# EAGLE design muledrum-vcos (EAGLE 6.6.0)

## Sheet 1 of 5: VCO1
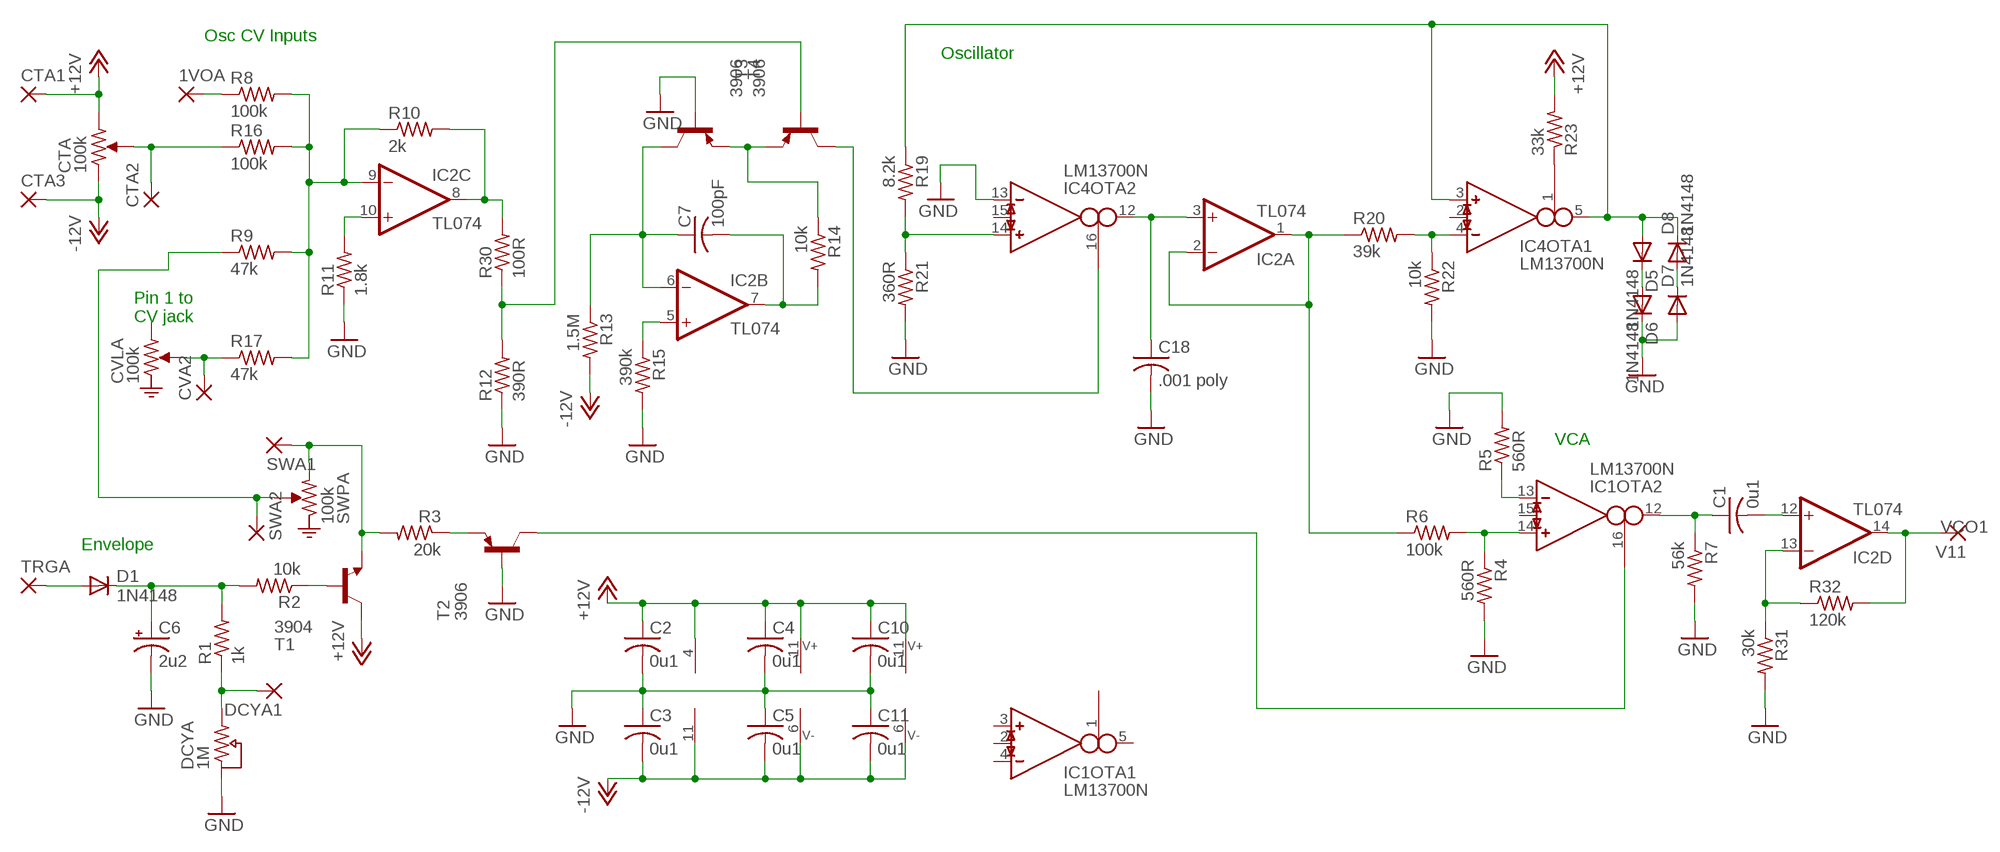
[diagram p0: schematic, sheet 1]

### Parts
1VOA  2,54/1,0  [2,54/1,0]
C1  0u1  C-US050-025X075  [C050-025X075]
C2  0u1  C-US050-025X075  [C050-025X075]
C3  0u1  C-US050-025X075  [C050-025X075]
C4  0u1  C-US050-025X075  [C050-025X075]
C5  0u1  C-US050-025X075  [C050-025X075]
C6  2u2  CPOL-USE2.5-5  [E2,5-5]
C7  100pF  C-US050-025X075  [C050-025X075]
C10  0u1  C-US050-025X075  [C050-025X075]
C11  0u1  C-US050-025X075  [C050-025X075]
C18  .001 poly  C-US050-025X075  [C050-025X075]
CTA  100k  POT  (no package)
CTA1  2,54/1,0  [2,54/1,0]
CTA2  2,54/1,0  [2,54/1,0]
CTA3  2,54/1,0  [2,54/1,0]
CVA2  2,54/1,0  [2,54/1,0]
CVLA  100k  POT-ATTEN  (no package)
D1  1N4148  1N4148DO35-7  [DO35-7]
D5  1N4148  1N4148DO35-7  [DO35-7]
D6  1N4148  1N4148DO35-7  [DO35-7]
D7  1N4148  1N4148DO35-7  [DO35-7]
D8  1N4148  1N4148DO35-7  [DO35-7]
DCYA  1M  POT-RHEO  (no package)
DCYA1  2,54/1,0  [2,54/1,0]
IC1  LM13700N  [DIL16]
IC2  TL074  TL074-TOPP  [DIL14]
IC4  LM13700N  [DIL16]
R1  1k  R-US_0207/10  [0207/10]
R2  10k  R-US_0207/10  [0207/10]
R3  20k  R-US_0207/10  [0207/10]
R4  560R  R-US_0207/10  [0207/10]
R5  560R  R-US_0207/10  [0207/10]
R6  100k  R-US_0207/10  [0207/10]
R7  56k  R-US_0207/10  [0207/10]
R8  100k  R-US_0207/10  [0207/10]
R9  47k  R-US_0207/10  [0207/10]
R10  2k  R-US_0207/10  [0207/10]
R11  1.8k  R-US_0207/10  [0207/10]
R12  390R  R-US_0207/10  [0207/10]
R13  1.5M  R-US_0207/10  [0207/10]
R14  10k  R-US_0207/10  [0207/10]
R15  390k  R-US_0207/10  [0207/10]
R16  100k  R-US_0207/10  [0207/10]
R17  47k  R-US_0207/10  [0207/10]
R19  8.2k  R-US_0207/10  [0207/10]
R20  39k  R-US_0207/10  [0207/10]
R21  360R  R-US_0207/10  [0207/10]
R22  10k  R-US_0207/10  [0207/10]
R23  33k  R-US_0207/10  [0207/10]
R30  100R  R-US_0207/10  [0207/10]
R31  30k  R-US_0207/10  [0207/10]
R32  120k  R-US_0207/10  [0207/10]
SWA1  2,54/1,0  [2,54/1,0]
SWA2  2,54/1,0  [2,54/1,0]
SWPA  100k  POT-ATTEN  (no package)
T1  3904  -NPN-TO92-EBC  [TO92-EBC]
T2  3906  -PNP-TO92-EBC  [TO92-EBC]
T3  3906  2N3906-PNP-TO92-EBC  [TO92-EBC]
T4  3906  2N3906-PNP-TO92-EBC  [TO92-EBC]
TRGA  2,54/1,0  [2,54/1,0]
V11  2,54/1,0  [2,54/1,0]

### Nets
+12V: C2.1 C4.1 C10.1 CTA1.1(P) CTA.1 IC1.11 IC2.4(P:V+) IC4.11 R23.2 T1.C ; also sheet 2,3,4,5
-12V: C3.2 C5.2 C11.2 CTA3.1(P) CTA.3 IC1.6 IC2.11(P:V-) IC4.6 R13.2 ; also sheet 2,3,4,5
GND: C2.2 C3.1 C4.2 C5.1 C6.- C10.2 C11.1 C18.2 D6.C D7.A DCYA.3 IC4.13(OTA2:IN_N) R4.2 R5.2 R7.2 R11.1 R12.1 R15.2 R21.2 R22.2 R31.2 T2.B T4.B ; also sheet 2,3,4,5
N$1: R2.1 T1.B
N$2: R3.2 SWA1.1(P) SWPA.1 T1.E
N$3: R3.1 T2.E
N$4: C6.+ D1.C R1.2 R2.2
N$5: DCYA1.1(P) DCYA.1 R1.1
N$6: IC1.16(OTA2:I_BIAS) T2.C
N$7: IC1.14(OTA2:IN_P) R4.1 R6.2
N$8: IC1.13(OTA2:IN_N) R5.1
N$9: C1.1 IC1.12(OTA2:OUT) R7.1
N$10: D1.A TRGA.1(P)
N$11: R9.1 SWA2.1(P) SWPA.2
N$12: CTA2.1(P) CTA.2 R16.1
N$13: C1.2 IC2.12(D:+IN)
N$14: 1VOA.1(P) R8.1
N$15: IC2.10(C:+IN) R11.2
N$16: IC2.9(C:-IN) R8.2 R9.2 R10.1 R16.2 R17.2
N$17: IC2.8(C:OUT) R10.2 R30.2
N$18: IC2.13(D:-IN) R31.1 R32.1
N$19: R14.1 T3.E T4.E
N$20: CVA2.1(P) CVLA.2 R17.1
N$21: C7.1 IC2.6(B:-IN) R13.1 T4.C
N$22: C7.2 IC2.7(B:OUT) R14.2
N$23: IC2.5(B:+IN) R15.1
N$24: R12.2 R30.1 T3.B
N$25: IC4.16(OTA2:I_BIAS) T3.C
N$26: IC4.14(OTA2:IN_P) R19.2 R21.1
N$27: IC4.4(OTA1:IN_N) R20.2 R22.1
N$28: C18.1 IC2.3(A:+IN) IC4.12(OTA2:OUT)
N$52: IC4.1(OTA1:I_BIAS) R23.1
N$56: D5.C D6.A
N$57: D7.C D8.A
OSCOS: D5.A D8.C IC4.3(OTA1:IN_P) IC4.5(OTA1:OUT) R19.1
OSCOT: IC2.1(A:OUT) IC2.2(A:-IN) R6.1 R20.1
VCO1: IC2.14(D:OUT) R32.2 V11.1(P)
Unconnected: CVLA.1 IC1.1(OTA1:I_BIAS) IC1.2(OTA1:I_DIODE) IC1.3(OTA1:IN_P) IC1.4(OTA1:IN_N) IC1.5(OTA1:OUT) IC1.7(BUF1:B) IC1.8(BUF1:E) IC1.9(BUF2:E) IC1.10(BUF2:B) IC1.15(OTA2:I_DIODE) IC4.2(OTA1:I_DIODE) IC4.7(BUF1:B) IC4.8(BUF1:E) IC4.9(BUF2:E) IC4.10(BUF2:B) IC4.15(OTA2:I_DIODE)

### Notes on the sheet
- Osc CV Inputs
- Oscillator
- Pin 1 to
  CV jack
- VCA
- Envelope

## Sheet 2 of 5: VCO2
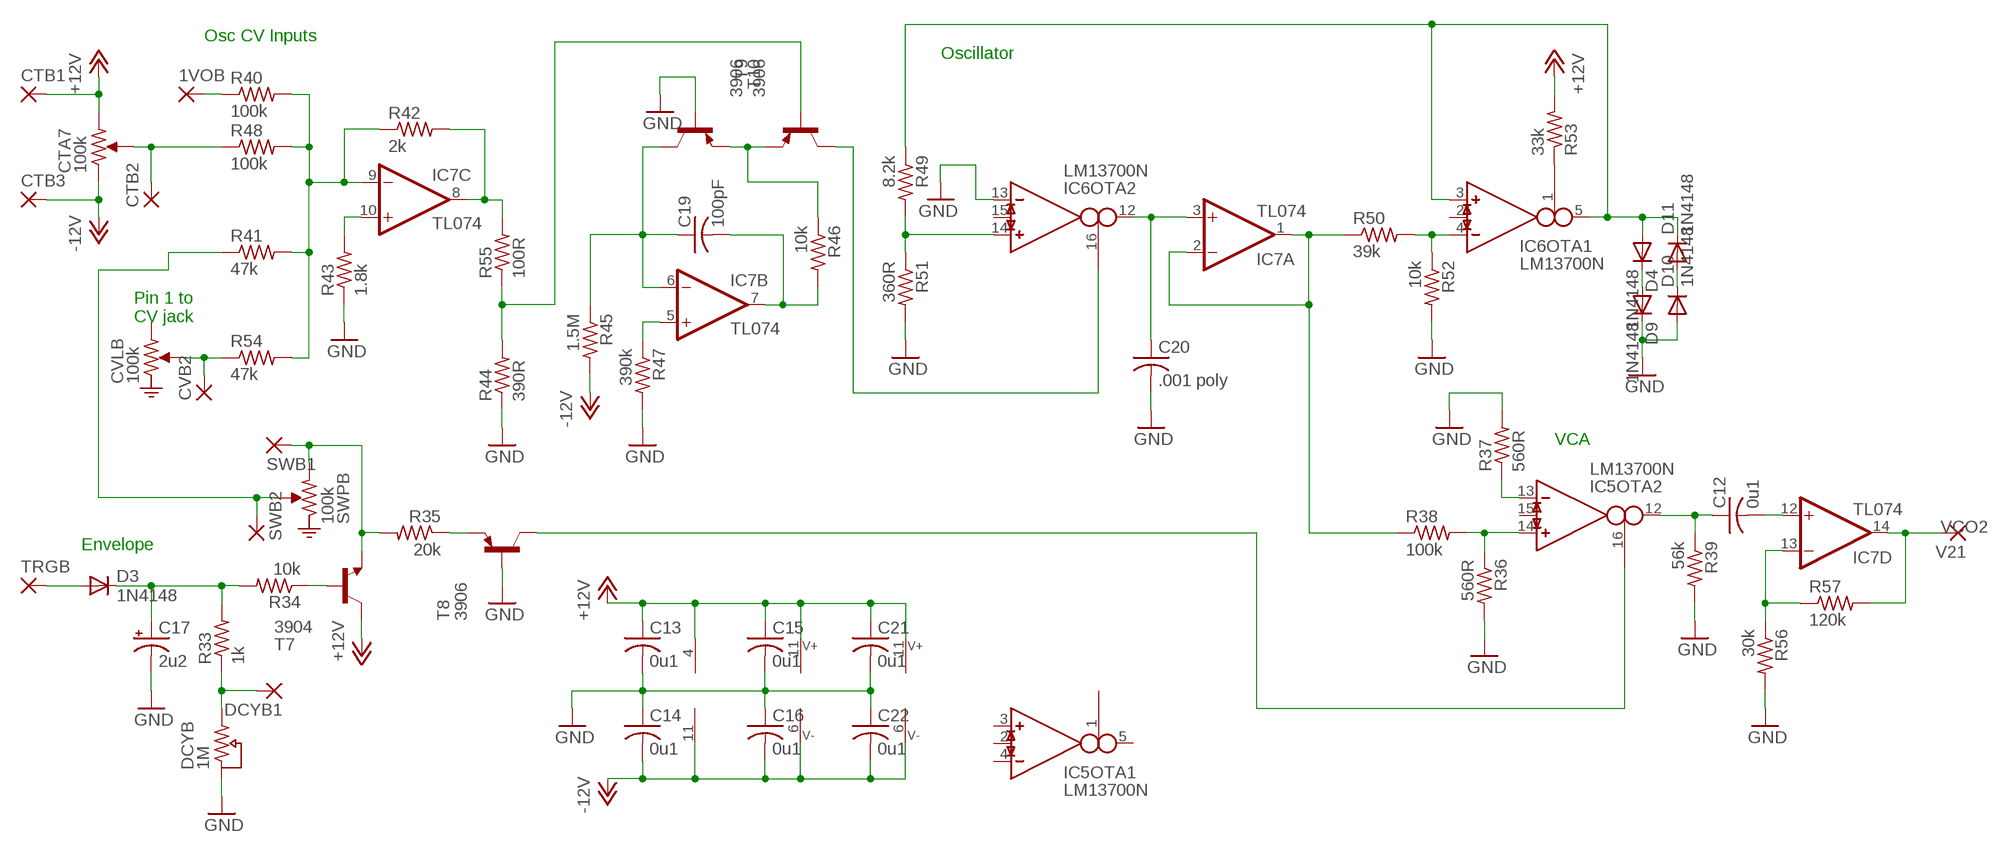
[diagram p1: schematic, sheet 2]

### Parts
1VOB  2,54/1,0  [2,54/1,0]
C12  0u1  C-US050-025X075  [C050-025X075]
C13  0u1  C-US050-025X075  [C050-025X075]
C14  0u1  C-US050-025X075  [C050-025X075]
C15  0u1  C-US050-025X075  [C050-025X075]
C16  0u1  C-US050-025X075  [C050-025X075]
C17  2u2  CPOL-USE2.5-5  [E2,5-5]
C19  100pF  C-US050-025X075  [C050-025X075]
C20  .001 poly  C-US050-025X075  [C050-025X075]
C21  0u1  C-US050-025X075  [C050-025X075]
C22  0u1  C-US050-025X075  [C050-025X075]
CTA7  100k  POT  (no package)
CTB1  2,54/1,0  [2,54/1,0]
CTB2  2,54/1,0  [2,54/1,0]
CTB3  2,54/1,0  [2,54/1,0]
CVB2  2,54/1,0  [2,54/1,0]
CVLB  100k  POT-ATTEN  (no package)
D3  1N4148  1N4148DO35-7  [DO35-7]
D4  1N4148  1N4148DO35-7  [DO35-7]
D9  1N4148  1N4148DO35-7  [DO35-7]
D10  1N4148  1N4148DO35-7  [DO35-7]
D11  1N4148  1N4148DO35-7  [DO35-7]
DCYB  1M  POT-RHEO  (no package)
DCYB1  2,54/1,0  [2,54/1,0]
IC5  LM13700N  [DIL16]
IC6  LM13700N  [DIL16]
IC7  TL074  TL074-TOPP  [DIL14]
R33  1k  R-US_0207/10  [0207/10]
R34  10k  R-US_0207/10  [0207/10]
R35  20k  R-US_0207/10  [0207/10]
R36  560R  R-US_0207/10  [0207/10]
R37  560R  R-US_0207/10  [0207/10]
R38  100k  R-US_0207/10  [0207/10]
R39  56k  R-US_0207/10  [0207/10]
R40  100k  R-US_0207/10  [0207/10]
R41  47k  R-US_0207/10  [0207/10]
R42  2k  R-US_0207/10  [0207/10]
R43  1.8k  R-US_0207/10  [0207/10]
R44  390R  R-US_0207/10  [0207/10]
R45  1.5M  R-US_0207/10  [0207/10]
R46  10k  R-US_0207/10  [0207/10]
R47  390k  R-US_0207/10  [0207/10]
R48  100k  R-US_0207/10  [0207/10]
R49  8.2k  R-US_0207/10  [0207/10]
R50  39k  R-US_0207/10  [0207/10]
R51  360R  R-US_0207/10  [0207/10]
R52  10k  R-US_0207/10  [0207/10]
R53  33k  R-US_0207/10  [0207/10]
R54  47k  R-US_0207/10  [0207/10]
R55  100R  R-US_0207/10  [0207/10]
R56  30k  R-US_0207/10  [0207/10]
R57  120k  R-US_0207/10  [0207/10]
SWB1  2,54/1,0  [2,54/1,0]
SWB2  2,54/1,0  [2,54/1,0]
SWPB  100k  POT-ATTEN  (no package)
T7  3904  -NPN-TO92-EBC  [TO92-EBC]
T8  3906  -PNP-TO92-EBC  [TO92-EBC]
T9  3906  2N3906-PNP-TO92-EBC  [TO92-EBC]
T10  3906  2N3906-PNP-TO92-EBC  [TO92-EBC]
TRGB  2,54/1,0  [2,54/1,0]
V21  2,54/1,0  [2,54/1,0]

### Nets
+12V: C13.1 C15.1 C21.1 CTA7.1 CTB1.1(P) IC5.11 IC6.11 IC7.4(P:V+) R53.2 T7.C ; also sheet 1,3,4,5
-12V: C14.2 C16.2 C22.2 CTA7.3 CTB3.1(P) IC5.6 IC6.6 IC7.11(P:V-) R45.2 ; also sheet 1,3,4,5
GND: C13.2 C14.1 C15.2 C16.1 C17.- C20.2 C21.2 C22.1 D9.C D10.A DCYB.3 IC6.13(OTA2:IN_N) R36.2 R37.2 R39.2 R43.1 R44.1 R47.2 R51.2 R52.2 R56.2 T8.B T10.B ; also sheet 1,3,4,5
N$40: C17.+ D3.C R33.2 R34.2
N$41: R34.1 T7.B
N$42: R35.2 SWB1.1(P) SWPB.1 T7.E
N$43: R35.1 T8.E
N$44: IC5.14(OTA2:IN_P) R36.1 R38.2
N$45: IC5.13(OTA2:IN_N) R37.1
N$46: C12.1 IC5.12(OTA2:OUT) R39.1
N$47: D3.A TRGB.1(P)
N$48: DCYB1.1(P) DCYB.1 R33.1
N$49: R41.1 SWB2.1(P) SWPB.2
N$50: 1VOB.1(P) R40.1
N$51: IC7.10(C:+IN) R43.2
N$53: IC7.9(C:-IN) R40.2 R41.2 R42.1 R48.2 R54.2
N$54: IC7.8(C:OUT) R42.2 R55.2
N$55: R46.1 T9.E T10.E
N$58: C19.1 IC7.6(B:-IN) R45.1 T10.C
N$59: C19.2 IC7.7(B:OUT) R46.2
N$60: IC7.5(B:+IN) R47.1
N$61: R44.2 R55.1 T9.B
N$62: IC6.14(OTA2:IN_P) R49.2 R51.1
N$63: IC6.4(OTA1:IN_N) R50.2 R52.1
N$64: IC6.1(OTA1:I_BIAS) R53.1
N$65: D4.C D9.A
N$66: D10.C D11.A
N$67: C20.1 IC6.12(OTA2:OUT) IC7.3(A:+IN)
N$68: CVB2.1(P) CVLB.2 R54.1
N$69: IC6.16(OTA2:I_BIAS) T9.C
N$70: IC5.16(OTA2:I_BIAS) T8.C
N$71: C12.2 IC7.12(D:+IN)
N$72: IC7.13(D:-IN) R56.1 R57.1
N$73: CTA7.2 CTB2.1(P) R48.1
OSCOS1: D4.A D11.C IC6.3(OTA1:IN_P) IC6.5(OTA1:OUT) R49.1
OSCOT1: IC7.1(A:OUT) IC7.2(A:-IN) R38.1 R50.1
VCO2: IC7.14(D:OUT) R57.2 V21.1(P)
Unconnected: CVLB.1 IC5.1(OTA1:I_BIAS) IC5.2(OTA1:I_DIODE) IC5.3(OTA1:IN_P) IC5.4(OTA1:IN_N) IC5.5(OTA1:OUT) IC5.7(BUF1:B) IC5.8(BUF1:E) IC5.9(BUF2:E) IC5.10(BUF2:B) IC5.15(OTA2:I_DIODE) IC6.2(OTA1:I_DIODE) IC6.7(BUF1:B) IC6.8(BUF1:E) IC6.9(BUF2:E) IC6.10(BUF2:B) IC6.15(OTA2:I_DIODE)

### Notes on the sheet
- Osc CV Inputs
- Oscillator
- Pin 1 to
  CV jack
- VCA
- Envelope

## Sheet 3 of 5: VCO3
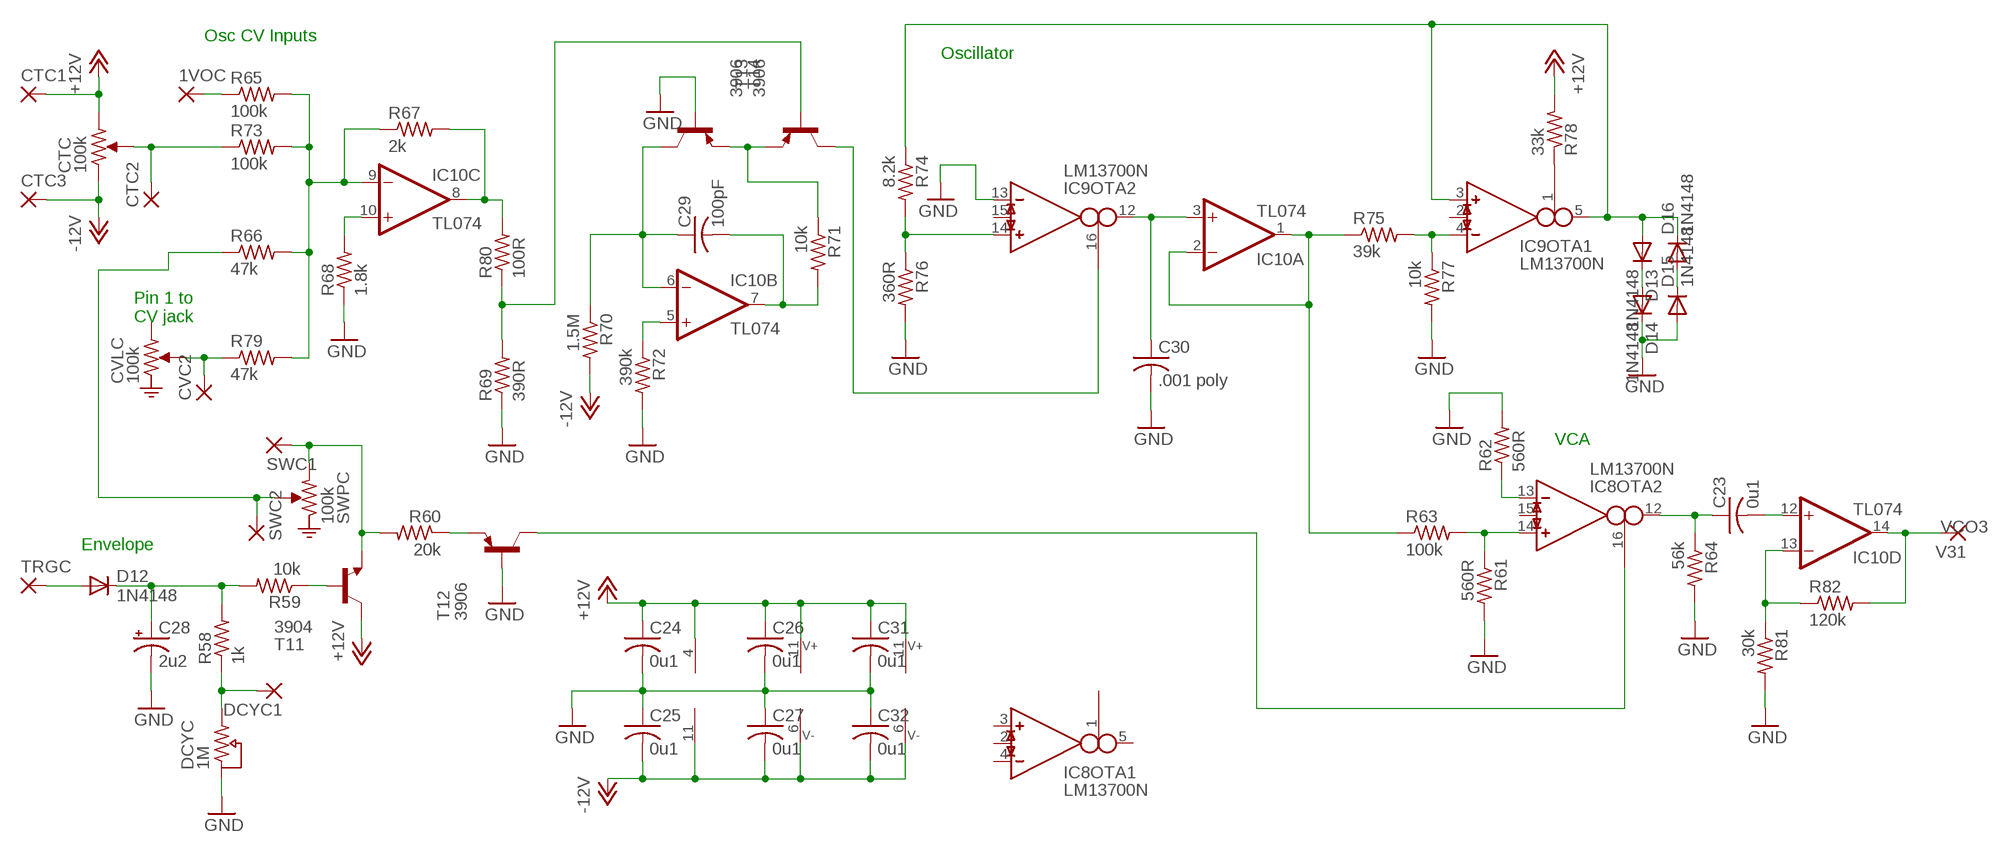
[diagram p2: schematic, sheet 3]

### Parts
1VOC  2,54/1,0  [2,54/1,0]
C23  0u1  C-US050-025X075  [C050-025X075]
C24  0u1  C-US050-025X075  [C050-025X075]
C25  0u1  C-US050-025X075  [C050-025X075]
C26  0u1  C-US050-025X075  [C050-025X075]
C27  0u1  C-US050-025X075  [C050-025X075]
C28  2u2  CPOL-USE2.5-5  [E2,5-5]
C29  100pF  C-US050-025X075  [C050-025X075]
C30  .001 poly  C-US050-025X075  [C050-025X075]
C31  0u1  C-US050-025X075  [C050-025X075]
C32  0u1  C-US050-025X075  [C050-025X075]
CTC  100k  POT  (no package)
CTC1  2,54/1,0  [2,54/1,0]
CTC2  2,54/1,0  [2,54/1,0]
CTC3  2,54/1,0  [2,54/1,0]
CVC2  2,54/1,0  [2,54/1,0]
CVLC  100k  POT-ATTEN  (no package)
D12  1N4148  1N4148DO35-7  [DO35-7]
D13  1N4148  1N4148DO35-7  [DO35-7]
D14  1N4148  1N4148DO35-7  [DO35-7]
D15  1N4148  1N4148DO35-7  [DO35-7]
D16  1N4148  1N4148DO35-7  [DO35-7]
DCYC  1M  POT-RHEO  (no package)
DCYC1  2,54/1,0  [2,54/1,0]
IC8  LM13700N  [DIL16]
IC9  LM13700N  [DIL16]
IC10  TL074  TL074-TOPP  [DIL14]
R58  1k  R-US_0207/10  [0207/10]
R59  10k  R-US_0207/10  [0207/10]
R60  20k  R-US_0207/10  [0207/10]
R61  560R  R-US_0207/10  [0207/10]
R62  560R  R-US_0207/10  [0207/10]
R63  100k  R-US_0207/10  [0207/10]
R64  56k  R-US_0207/10  [0207/10]
R65  100k  R-US_0207/10  [0207/10]
R66  47k  R-US_0207/10  [0207/10]
R67  2k  R-US_0207/10  [0207/10]
R68  1.8k  R-US_0207/10  [0207/10]
R69  390R  R-US_0207/10  [0207/10]
R70  1.5M  R-US_0207/10  [0207/10]
R71  10k  R-US_0207/10  [0207/10]
R72  390k  R-US_0207/10  [0207/10]
R73  100k  R-US_0207/10  [0207/10]
R74  8.2k  R-US_0207/10  [0207/10]
R75  39k  R-US_0207/10  [0207/10]
R76  360R  R-US_0207/10  [0207/10]
R77  10k  R-US_0207/10  [0207/10]
R78  33k  R-US_0207/10  [0207/10]
R79  47k  R-US_0207/10  [0207/10]
R80  100R  R-US_0207/10  [0207/10]
R81  30k  R-US_0207/10  [0207/10]
R82  120k  R-US_0207/10  [0207/10]
SWC1  2,54/1,0  [2,54/1,0]
SWC2  2,54/1,0  [2,54/1,0]
SWPC  100k  POT-ATTEN  (no package)
T11  3904  -NPN-TO92-EBC  [TO92-EBC]
T12  3906  -PNP-TO92-EBC  [TO92-EBC]
T13  3906  2N3906-PNP-TO92-EBC  [TO92-EBC]
T14  3906  2N3906-PNP-TO92-EBC  [TO92-EBC]
TRGC  2,54/1,0  [2,54/1,0]
V31  2,54/1,0  [2,54/1,0]

### Nets
+12V: C24.1 C26.1 C31.1 CTC1.1(P) CTC.1 IC8.11 IC9.11 IC10.4(P:V+) R78.2 T11.C ; also sheet 1,2,4,5
-12V: C25.2 C27.2 C32.2 CTC3.1(P) CTC.3 IC8.6 IC9.6 IC10.11(P:V-) R70.2 ; also sheet 1,2,4,5
GND: C24.2 C25.1 C26.2 C27.1 C28.- C30.2 C31.2 C32.1 D14.C D15.A DCYC.3 IC9.13(OTA2:IN_N) R61.2 R62.2 R64.2 R68.1 R69.1 R72.2 R76.2 R77.2 R81.2 T12.B T14.B ; also sheet 1,2,4,5
N$74: C28.+ D12.C R58.2 R59.2
N$75: R59.1 T11.B
N$76: R60.2 SWC1.1(P) SWPC.1 T11.E
N$77: R60.1 T12.E
N$78: IC8.14(OTA2:IN_P) R61.1 R63.2
N$79: IC8.13(OTA2:IN_N) R62.1
N$80: C23.1 IC8.12(OTA2:OUT) R64.1
N$81: D12.A TRGC.1(P)
N$82: DCYC1.1(P) DCYC.1 R58.1
N$83: R66.1 SWC2.1(P) SWPC.2
N$84: 1VOC.1(P) R65.1
N$85: IC10.10(C:+IN) R68.2
N$86: IC10.9(C:-IN) R65.2 R66.2 R67.1 R73.2 R79.2
N$87: IC10.8(C:OUT) R67.2 R80.2
N$88: R71.1 T13.E T14.E
N$89: C29.1 IC10.6(B:-IN) R70.1 T14.C
N$90: C29.2 IC10.7(B:OUT) R71.2
N$91: IC10.5(B:+IN) R72.1
N$92: R69.2 R80.1 T13.B
N$93: IC9.14(OTA2:IN_P) R74.2 R76.1
N$94: IC9.4(OTA1:IN_N) R75.2 R77.1
N$95: IC9.1(OTA1:I_BIAS) R78.1
N$96: D13.C D14.A
N$97: D15.C D16.A
N$98: C30.1 IC9.12(OTA2:OUT) IC10.3(A:+IN)
N$99: CVC2.1(P) CVLC.2 R79.1
N$100: IC9.16(OTA2:I_BIAS) T13.C
N$101: IC8.16(OTA2:I_BIAS) T12.C
N$102: C23.2 IC10.12(D:+IN)
N$103: IC10.13(D:-IN) R81.1 R82.1
N$104: CTC2.1(P) CTC.2 R73.1
OSCOS2: D13.A D16.C IC9.3(OTA1:IN_P) IC9.5(OTA1:OUT) R74.1
OSCOT2: IC10.1(A:OUT) IC10.2(A:-IN) R63.1 R75.1
VCO3: IC10.14(D:OUT) R82.2 V31.1(P)
Unconnected: CVLC.1 IC8.1(OTA1:I_BIAS) IC8.2(OTA1:I_DIODE) IC8.3(OTA1:IN_P) IC8.4(OTA1:IN_N) IC8.5(OTA1:OUT) IC8.7(BUF1:B) IC8.8(BUF1:E) IC8.9(BUF2:E) IC8.10(BUF2:B) IC8.15(OTA2:I_DIODE) IC9.2(OTA1:I_DIODE) IC9.7(BUF1:B) IC9.8(BUF1:E) IC9.9(BUF2:E) IC9.10(BUF2:B) IC9.15(OTA2:I_DIODE)

### Notes on the sheet
- Osc CV Inputs
- Oscillator
- Pin 1 to
  CV jack
- VCA
- Envelope

## Sheet 4 of 5: Ring VCOs
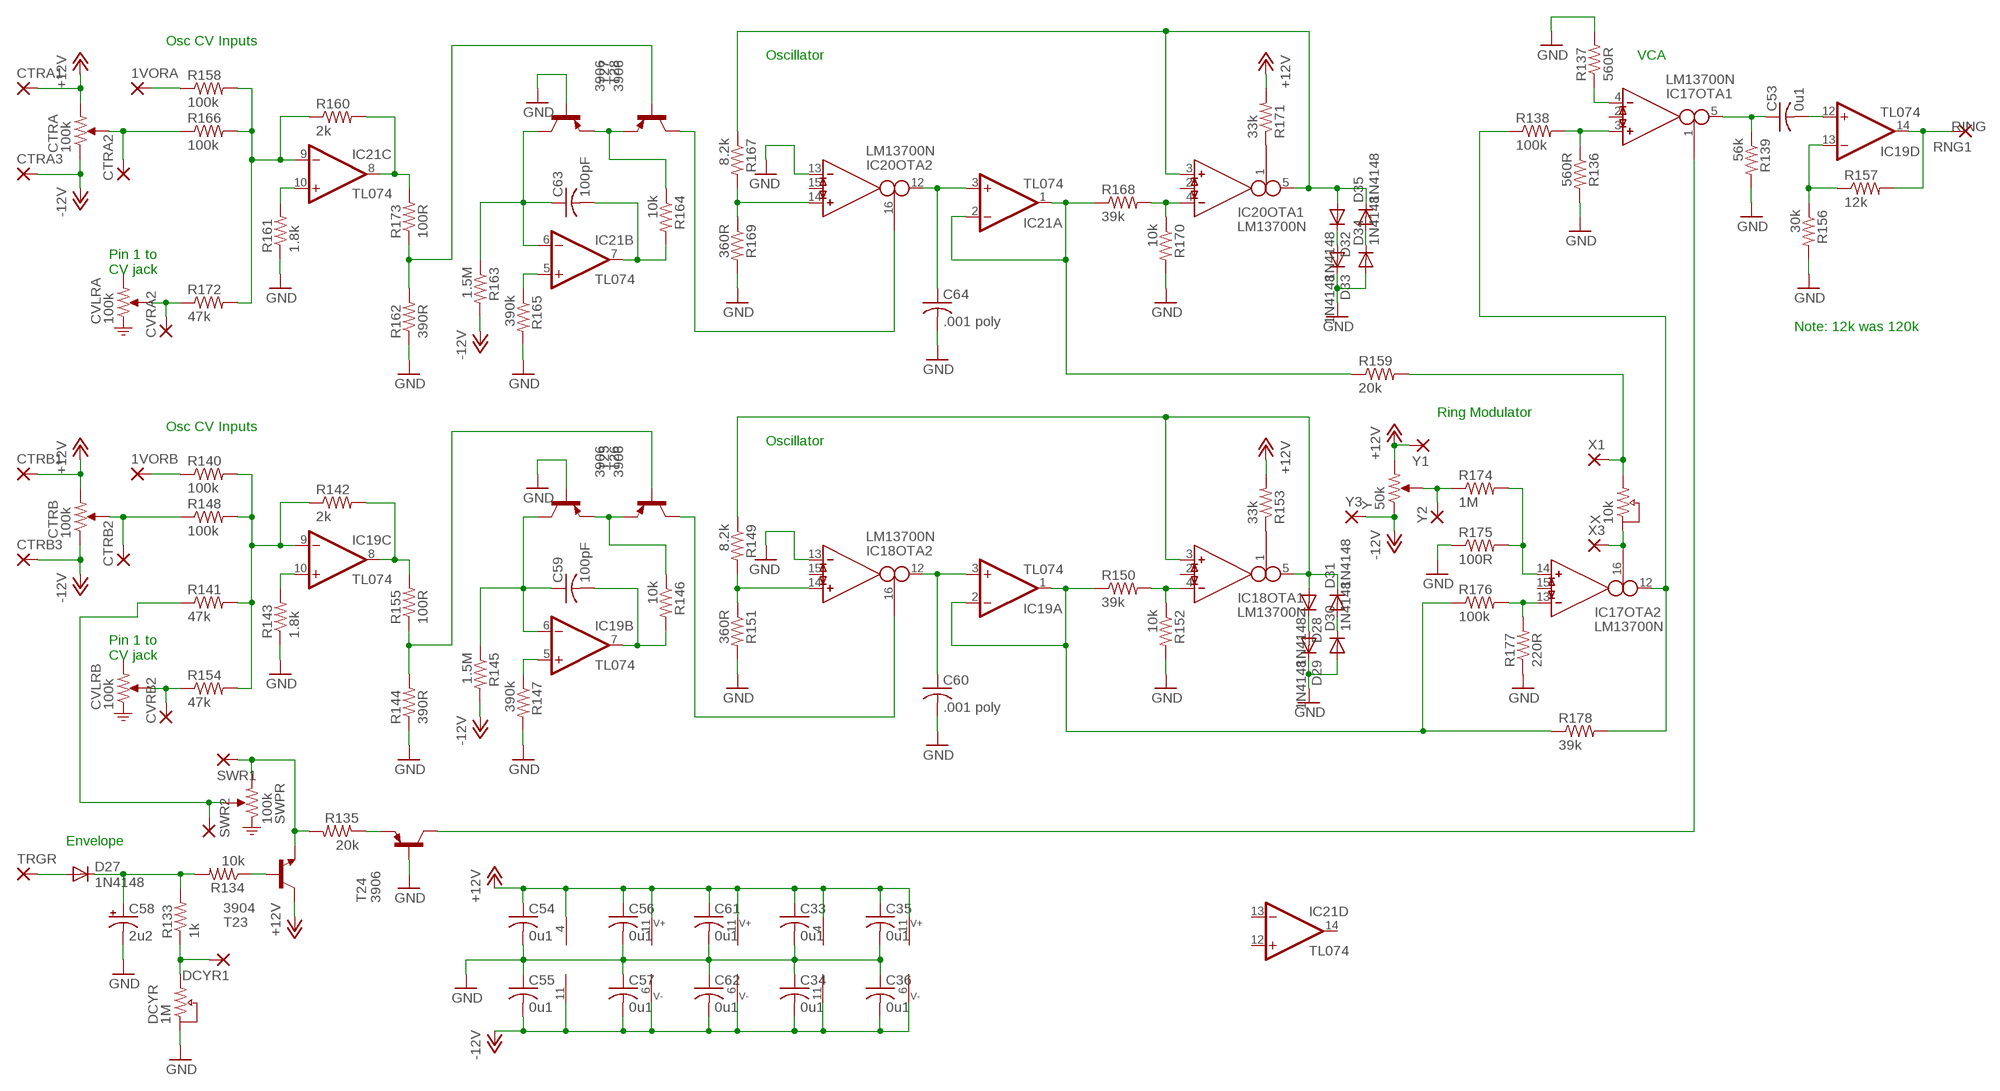
[diagram p3: schematic, sheet 4]

### Parts
1VORA  2,54/1,0  [2,54/1,0]
1VORB  2,54/1,0  [2,54/1,0]
C33  0u1  C-US050-025X075  [C050-025X075]
C34  0u1  C-US050-025X075  [C050-025X075]
C35  0u1  C-US050-025X075  [C050-025X075]
C36  0u1  C-US050-025X075  [C050-025X075]
C53  0u1  C-US050-025X075  [C050-025X075]
C54  0u1  C-US050-025X075  [C050-025X075]
C55  0u1  C-US050-025X075  [C050-025X075]
C56  0u1  C-US050-025X075  [C050-025X075]
C57  0u1  C-US050-025X075  [C050-025X075]
C58  2u2  CPOL-USE2.5-5  [E2,5-5]
C59  100pF  C-US050-025X075  [C050-025X075]
C60  .001 poly  C-US050-025X075  [C050-025X075]
C61  0u1  C-US050-025X075  [C050-025X075]
C62  0u1  C-US050-025X075  [C050-025X075]
C63  100pF  C-US050-025X075  [C050-025X075]
C64  .001 poly  C-US050-025X075  [C050-025X075]
CTRA  100k  POT  (no package)
CTRA1  2,54/1,0  [2,54/1,0]
CTRA2  2,54/1,0  [2,54/1,0]
CTRA3  2,54/1,0  [2,54/1,0]
CTRB  100k  POT  (no package)
CTRB1  2,54/1,0  [2,54/1,0]
CTRB2  2,54/1,0  [2,54/1,0]
CTRB3  2,54/1,0  [2,54/1,0]
CVLRA  100k  POT-ATTEN  (no package)
CVLRB  100k  POT-ATTEN  (no package)
CVRA2  2,54/1,0  [2,54/1,0]
CVRB2  2,54/1,0  [2,54/1,0]
D27  1N4148  1N4148DO35-7  [DO35-7]
D28  1N4148  1N4148DO35-7  [DO35-7]
D29  1N4148  1N4148DO35-7  [DO35-7]
D30  1N4148  1N4148DO35-7  [DO35-7]
D31  1N4148  1N4148DO35-7  [DO35-7]
D32  1N4148  1N4148DO35-7  [DO35-7]
D33  1N4148  1N4148DO35-7  [DO35-7]
D34  1N4148  1N4148DO35-7  [DO35-7]
D35  1N4148  1N4148DO35-7  [DO35-7]
DCYR  1M  POT-RHEO  (no package)
DCYR1  2,54/1,0  [2,54/1,0]
IC17  LM13700N  [DIL16]
IC18  LM13700N  [DIL16]
IC19  TL074  TL074-TOPP  [DIL14]
IC20  LM13700N  [DIL16]
IC21  TL074  TL074-TOPP  [DIL14]
R133  1k  R-US_0207/10  [0207/10]
R134  10k  R-US_0207/10  [0207/10]
R135  20k  R-US_0207/10  [0207/10]
R136  560R  R-US_0207/10  [0207/10]
R137  560R  R-US_0207/10  [0207/10]
R138  100k  R-US_0207/10  [0207/10]
R139  56k  R-US_0207/10  [0207/10]
R140  100k  R-US_0207/10  [0207/10]
R141  47k  R-US_0207/10  [0207/10]
R142  2k  R-US_0207/10  [0207/10]
R143  1.8k  R-US_0207/10  [0207/10]
R144  390R  R-US_0207/10  [0207/10]
R145  1.5M  R-US_0207/10  [0207/10]
R146  10k  R-US_0207/10  [0207/10]
R147  390k  R-US_0207/10  [0207/10]
R148  100k  R-US_0207/10  [0207/10]
R149  8.2k  R-US_0207/10  [0207/10]
R150  39k  R-US_0207/10  [0207/10]
R151  360R  R-US_0207/10  [0207/10]
R152  10k  R-US_0207/10  [0207/10]
R153  33k  R-US_0207/10  [0207/10]
R154  47k  R-US_0207/10  [0207/10]
R155  100R  R-US_0207/10  [0207/10]
R156  30k  R-US_0207/10  [0207/10]
R157  12k  R-US_0207/10  [0207/10]
R158  100k  R-US_0207/10  [0207/10]
R159  20k  R-US_0207/10  [0207/10]
R160  2k  R-US_0207/10  [0207/10]
R161  1.8k  R-US_0207/10  [0207/10]
R162  390R  R-US_0207/10  [0207/10]
R163  1.5M  R-US_0207/10  [0207/10]
R164  10k  R-US_0207/10  [0207/10]
R165  390k  R-US_0207/10  [0207/10]
R166  100k  R-US_0207/10  [0207/10]
R167  8.2k  R-US_0207/10  [0207/10]
R168  39k  R-US_0207/10  [0207/10]
R169  360R  R-US_0207/10  [0207/10]
R170  10k  R-US_0207/10  [0207/10]
R171  33k  R-US_0207/10  [0207/10]
R172  47k  R-US_0207/10  [0207/10]
R173  100R  R-US_0207/10  [0207/10]
R174  1M  R-US_0207/10  [0207/10]
R175  100R  R-US_0207/10  [0207/10]
R176  100k  R-US_0207/10  [0207/10]
R177  220R  R-US_0207/10  [0207/10]
R178  39k  R-US_0207/10  [0207/10]
RNG1  2,54/1,0  [2,54/1,0]
SWPR  100k  POT-ATTEN  (no package)
SWR1  2,54/1,0  [2,54/1,0]
SWR2  2,54/1,0  [2,54/1,0]
T23  3904  -NPN-TO92-EBC  [TO92-EBC]
T24  3906  -PNP-TO92-EBC  [TO92-EBC]
T25  3906  2N3906-PNP-TO92-EBC  [TO92-EBC]
T26  3906  2N3906-PNP-TO92-EBC  [TO92-EBC]
T27  3906  2N3906-PNP-TO92-EBC  [TO92-EBC]
T28  3906  2N3906-PNP-TO92-EBC  [TO92-EBC]
TRGR  2,54/1,0  [2,54/1,0]
X  10k  POT-RHEO  (no package)
X1  2,54/1,0  [2,54/1,0]
X3  2,54/1,0  [2,54/1,0]
Y  50k  POT  (no package)
Y1  2,54/1,0  [2,54/1,0]
Y2  2,54/1,0  [2,54/1,0]
Y3  2,54/1,0  [2,54/1,0]

### Nets
+12V: C33.1 C35.1 C54.1 C56.1 C61.1 CTRA1.1(P) CTRA.1 CTRB1.1(P) CTRB.1 IC17.11 IC18.11 IC19.4(P:V+) IC20.11 IC21.4(P:V+) R153.2 R171.2 T23.C Y1.1(P) Y.1 ; also sheet 1,2,3,5
-12V: C34.2 C36.2 C55.2 C57.2 C62.2 CTRA3.1(P) CTRA.3 CTRB3.1(P) CTRB.3 IC17.6 IC18.6 IC19.11(P:V-) IC20.6 IC21.11(P:V-) R145.2 R163.2 Y3.1(P) Y.3 ; also sheet 1,2,3,5
GND: C33.2 C34.1 C35.2 C36.1 C54.2 C55.1 C56.2 C57.1 C58.- C60.2 C61.2 C62.1 C64.2 D29.C D30.A D33.C D34.A DCYR.3 IC18.13(OTA2:IN_N) IC20.13(OTA2:IN_N) R136.2 R137.2 R139.2 R143.1 R144.1 R147.2 R151.2 R152.2 R156.2 R161.1 R162.1 R165.2 R169.2 R170.2 R175.1 R177.1 T24.B T26.B T28.B ; also sheet 1,2,3,5
N$167: C58.+ D27.C R133.2 R134.2
N$168: R134.1 T23.B
N$169: R135.2 SWPR.1 SWR1.1(P) T23.E
N$170: R135.1 T24.E
N$171: IC17.3(OTA1:IN_P) R136.1 R138.2
N$172: IC17.4(OTA1:IN_N) R137.1
N$173: C53.1 IC17.5(OTA1:OUT) R139.1
N$174: D27.A TRGR.1(P)
N$175: DCYR1.1(P) DCYR.1 R133.1
N$176: R141.1 SWPR.2 SWR2.1(P)
N$177: 1VORB.1(P) R140.1
N$178: IC19.10(C:+IN) R143.2
N$179: IC19.9(C:-IN) R140.2 R141.2 R142.1 R148.2 R154.2
N$180: IC19.8(C:OUT) R142.2 R155.2
N$181: R146.1 T25.E T26.E
N$182: C59.1 IC19.6(B:-IN) R145.1 T26.C
N$183: C59.2 IC19.7(B:OUT) R146.2
N$184: IC19.5(B:+IN) R147.1
N$185: R144.2 R155.1 T25.B
N$186: IC18.14(OTA2:IN_P) R149.2 R151.1
N$187: IC18.4(OTA1:IN_N) R150.2 R152.1
N$188: IC18.1(OTA1:I_BIAS) R153.1
N$189: D28.C D29.A
N$190: D30.C D31.A
N$191: C60.1 IC18.12(OTA2:OUT) IC19.3(A:+IN)
N$192: CVLRB.2 CVRB2.1(P) R154.1
N$193: IC18.16(OTA2:I_BIAS) T25.C
N$194: IC17.1(OTA1:I_BIAS) T24.C
N$195: C53.2 IC19.12(D:+IN)
N$196: IC19.13(D:-IN) R156.1 R157.1
N$197: CTRB2.1(P) CTRB.2 R148.1
N$198: IC17.16(OTA2:I_BIAS) X3.1(P) X.3
N$199: 1VORA.1(P) R158.1
N$200: IC21.10(C:+IN) R161.2
N$201: IC21.9(C:-IN) R158.2 R160.1 R166.2 R172.2
N$202: IC21.8(C:OUT) R160.2 R173.2
N$203: R164.1 T27.E T28.E
N$204: C63.1 IC21.6(B:-IN) R163.1 T28.C
N$205: C63.2 IC21.7(B:OUT) R164.2
N$206: IC21.5(B:+IN) R165.1
N$207: R162.2 R173.1 T27.B
N$208: IC20.14(OTA2:IN_P) R167.2 R169.1
N$209: IC20.4(OTA1:IN_N) R168.2 R170.1
N$210: IC20.1(OTA1:I_BIAS) R171.1
N$211: D32.C D33.A
N$212: D34.C D35.A
N$213: C64.1 IC20.12(OTA2:OUT) IC21.3(A:+IN)
N$214: CVLRA.2 CVRA2.1(P) R172.1
N$215: IC20.16(OTA2:I_BIAS) T27.C
N$216: CTRA2.1(P) CTRA.2 R166.1
N$217: R159.2 X1.1(P) X.1
N$218: R174.1 Y2.1(P) Y.2
N$219: IC17.14(OTA2:IN_P) R174.2 R175.2
N$220: IC17.13(OTA2:IN_N) R176.2 R177.2
N$221: IC17.12(OTA2:OUT) R138.1 R178.2
OSCOS5: D28.A D31.C IC18.3(OTA1:IN_P) IC18.5(OTA1:OUT) R149.1
OSCOS6: D32.A D35.C IC20.3(OTA1:IN_P) IC20.5(OTA1:OUT) R167.1
OSCOT5: IC19.1(A:OUT) IC19.2(A:-IN) R150.1 R176.1 R178.1
OSCOT6: IC21.1(A:OUT) IC21.2(A:-IN) R159.1 R168.1
RING: IC19.14(D:OUT) R157.2 RNG1.1(P)
Unconnected: CVLRA.1 CVLRB.1 IC17.2(OTA1:I_DIODE) IC17.7(BUF1:B) IC17.8(BUF1:E) IC17.9(BUF2:E) IC17.10(BUF2:B) IC17.15(OTA2:I_DIODE) IC18.2(OTA1:I_DIODE) IC18.7(BUF1:B) IC18.8(BUF1:E) IC18.9(BUF2:E) IC18.10(BUF2:B) IC18.15(OTA2:I_DIODE) IC20.2(OTA1:I_DIODE) IC20.7(BUF1:B) IC20.8(BUF1:E) IC20.9(BUF2:E) IC20.10(BUF2:B) IC20.15(OTA2:I_DIODE) IC21.12(D:+IN) IC21.13(D:-IN) IC21.14(D:OUT)

### Notes on the sheet
- Osc CV Inputs
- Oscillator | VCA
- Pin 1 to
  CV jack
- Note: 12k was 120k
- Ring Modulator
- Osc CV Inputs
- Oscillator
- Pin 1 to
  CV jack
- Envelope

## Sheet 5 of 5: Noise + Power
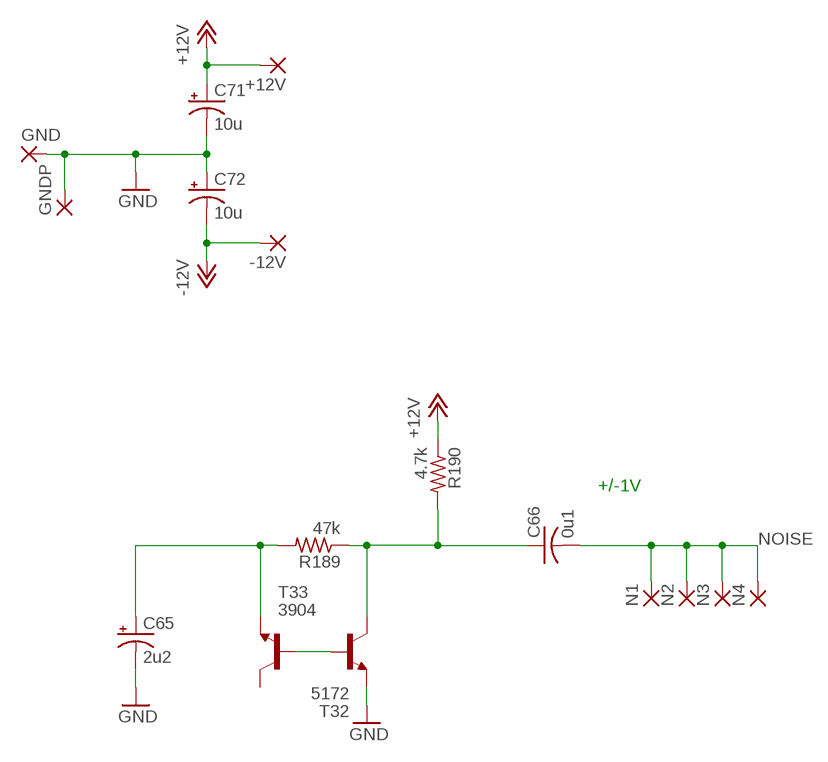
[diagram p4: schematic, sheet 5]

### Parts
+12V  2,54/1,0  [2,54/1,0]
-12V  2,54/1,0  [2,54/1,0]
C65  2u2  CPOL-USE2.5-5  [E2,5-5]
C66  0u1  C-US050-025X075  [C050-025X075]
C71  10u  CPOL-USE2.5-5  [E2,5-5]
C72  10u  CPOL-USE2.5-5  [E2,5-5]
GND  2,54/1,0  [2,54/1,0]
GNDP  2,54/1,0  [2,54/1,0]
N1  2,54/1,0  [2,54/1,0]
N2  2,54/1,0  [2,54/1,0]
N3  2,54/1,0  [2,54/1,0]
N4  2,54/1,0  [2,54/1,0]
R189  47k  R-US_0207/10  [0207/10]
R190  4.7k  R-US_0207/10  [0207/10]
T32  5172  BC368-NPN-TO92-ECB  [TO92-ECB]
T33  3904  -NPN-TO92-EBC  [TO92-EBC]

### Nets
+12V: +12V.1(P) C71.+ R190.1 ; also sheet 1,2,3,4
-12V: -12V.1(P) C72.- ; also sheet 1,2,3,4
GND: C65.- C71.- C72.+ GND.1(P) GNDP.1(P) T33.E ; also sheet 1,2,3,4
N$228: T32.B T33.B
N$229: C65.+ R189.2 T32.E
N$234: C66.1 R189.1 R190.2 T33.C
NOISE: C66.2 N1.1(P) N2.1(P) N3.1(P) N4.1(P)
Unconnected: T32.C

### Notes on the sheet
- +/-1V

## Library data of the parts
1VOA 1VOB 1VOC 1VORA 1VORB +12V -12V CTA1-CTA3 CTB1-CTB3 CTC1-CTC3 CTRA1-CTRA3 CTRB1-CTRB3 CVA2 CVB2 CVC2 CVRA2 CVRB2 DCYA1 DCYB1 DCYC1 DCYR1 GND GNDP N1-N4 RNG1 SWA1 SWA2 SWB1 SWB2 SWC1 SWC2 SWR1 SWR2 TRGA TRGB TRGC TRGR V11 V21 V31 X1 X3 Y1-Y3 = wirepad:2,54/1,0: THROUGH-HOLE PAD
C1-C5 C7 C10-C16 C18-C27 C29-C36 C53-C57 C59-C64 C66 = rcl:C-US: CAPACITOR, American symbol
C6 C17 C28 C58 C65 C71 C72 = rcl:CPOL-US: POLARIZED CAPACITOR, American symbol
CTA CTA7 CTC CTRA CTRB Y = mmoretti:POT
CVLA CVLB CVLC CVLRA CVLRB SWPA SWPB SWPC SWPR = mmoretti:POT-ATTEN
D1 D3-D16 D27-D35 = diode:1N4148: DIODE high speed (Philips)
DCYA DCYB DCYC DCYR X = mmoretti:POT-RHEO
IC1 IC4-IC6 IC8 IC9 IC17 IC18 IC20 = mmoretti:LM13700: Dual OTA with buffers
IC2 IC7 IC10 IC19 IC21 = mmoretti:TL074-TOP: OP AMP
R1-R17 R19-R23 R30-R82 R133-R178 R189 R190 = rcl:R-US_: RESISTOR, American symbol
T1 T7 T11 T23 T32 T33 = transistor-neu-to92:*-NPN-: NPN Transistror
T2-T4 T8-T10 T12-T14 T24-T28 = transistor-neu-to92:*-PNP-: PNP Transistror

## Board
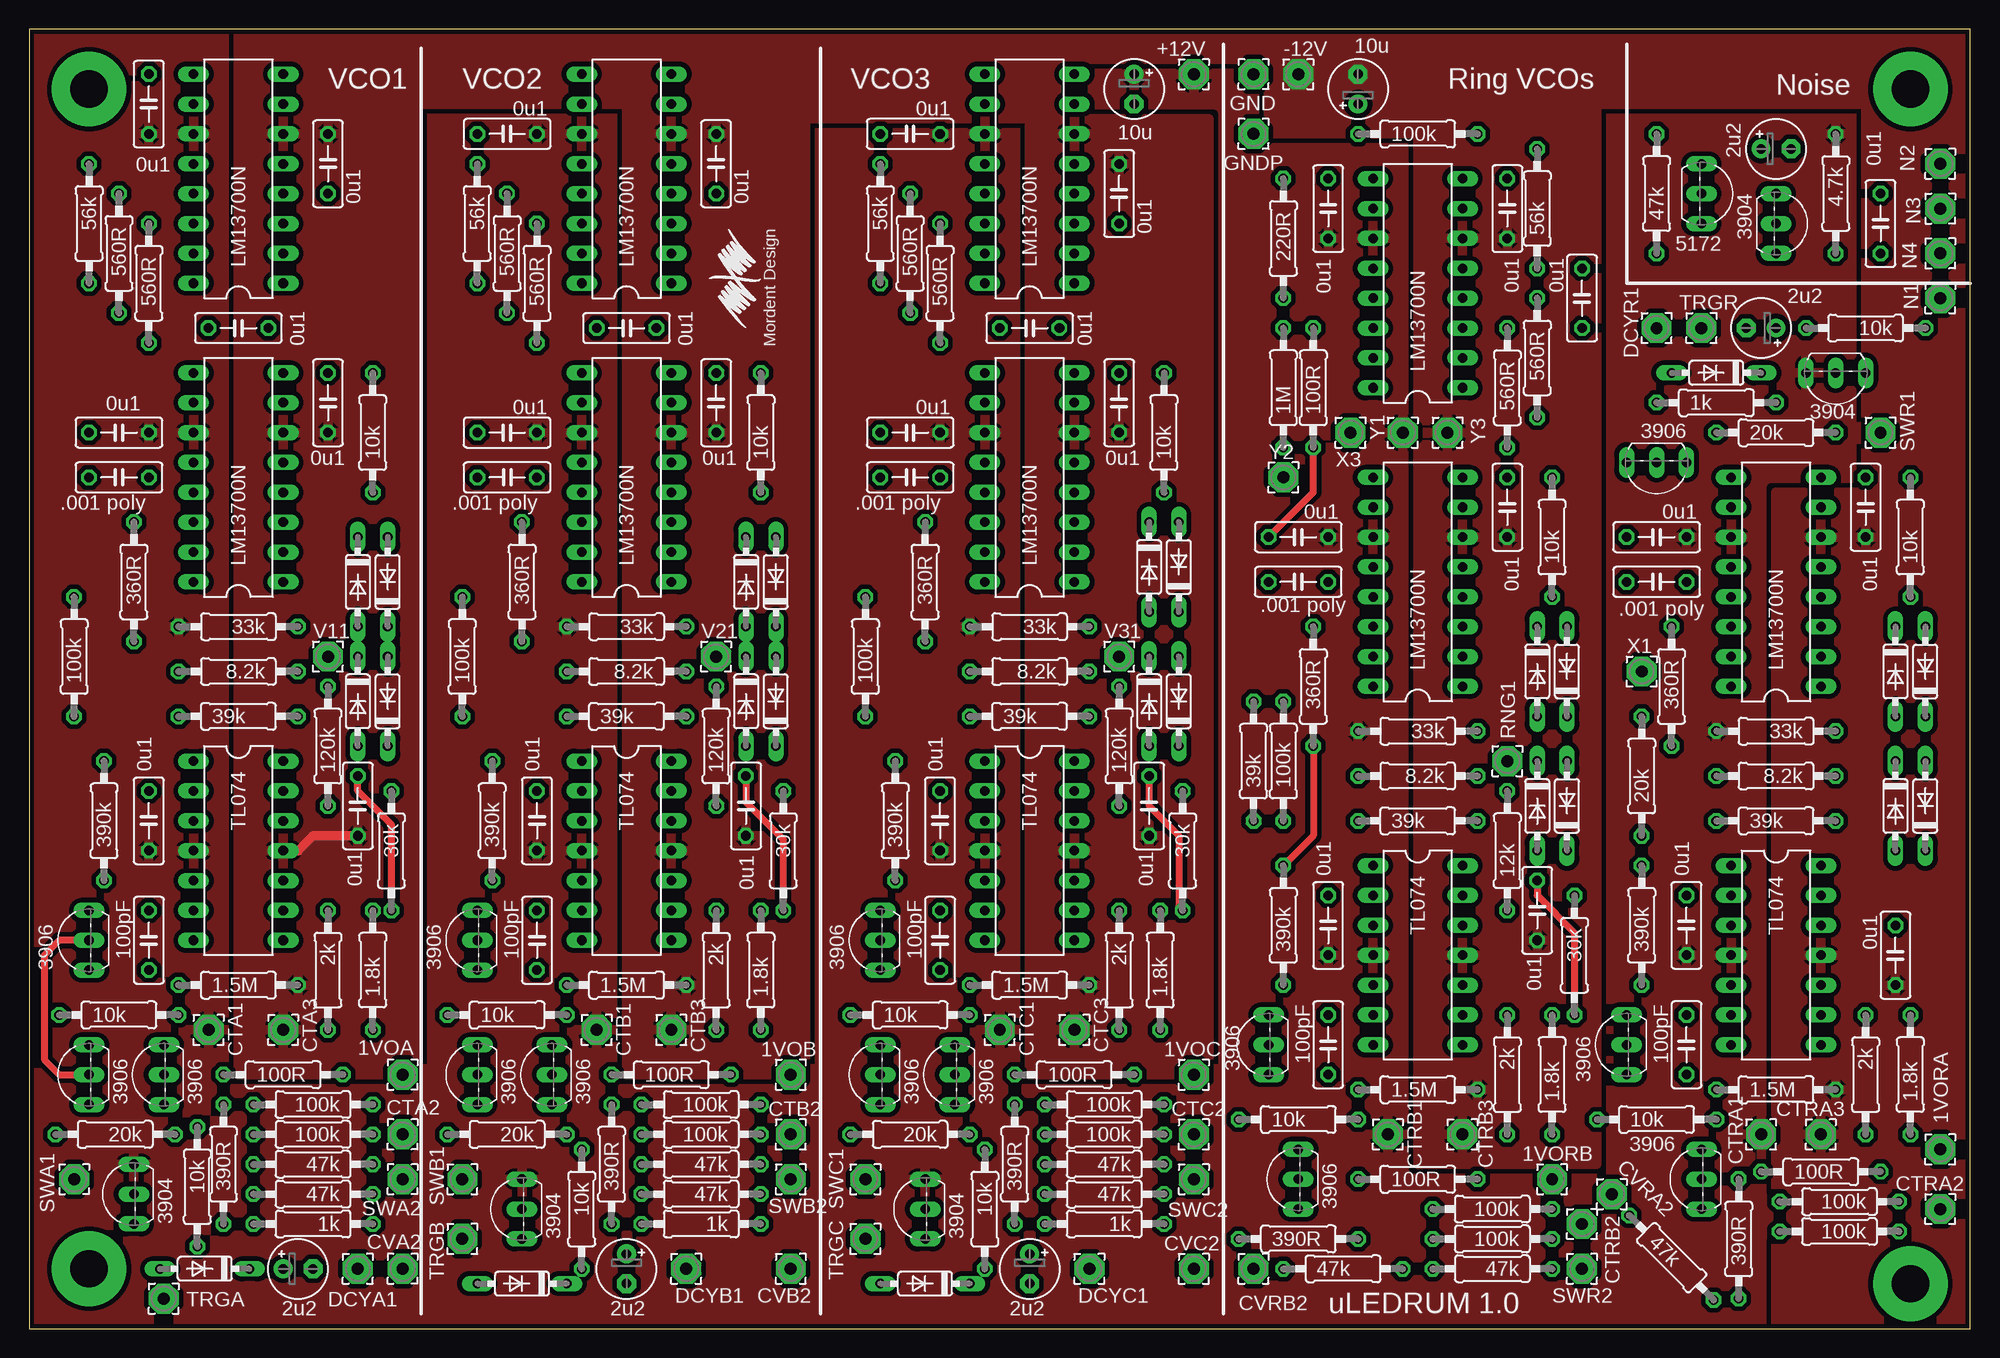
[diagram p5: board, top side]
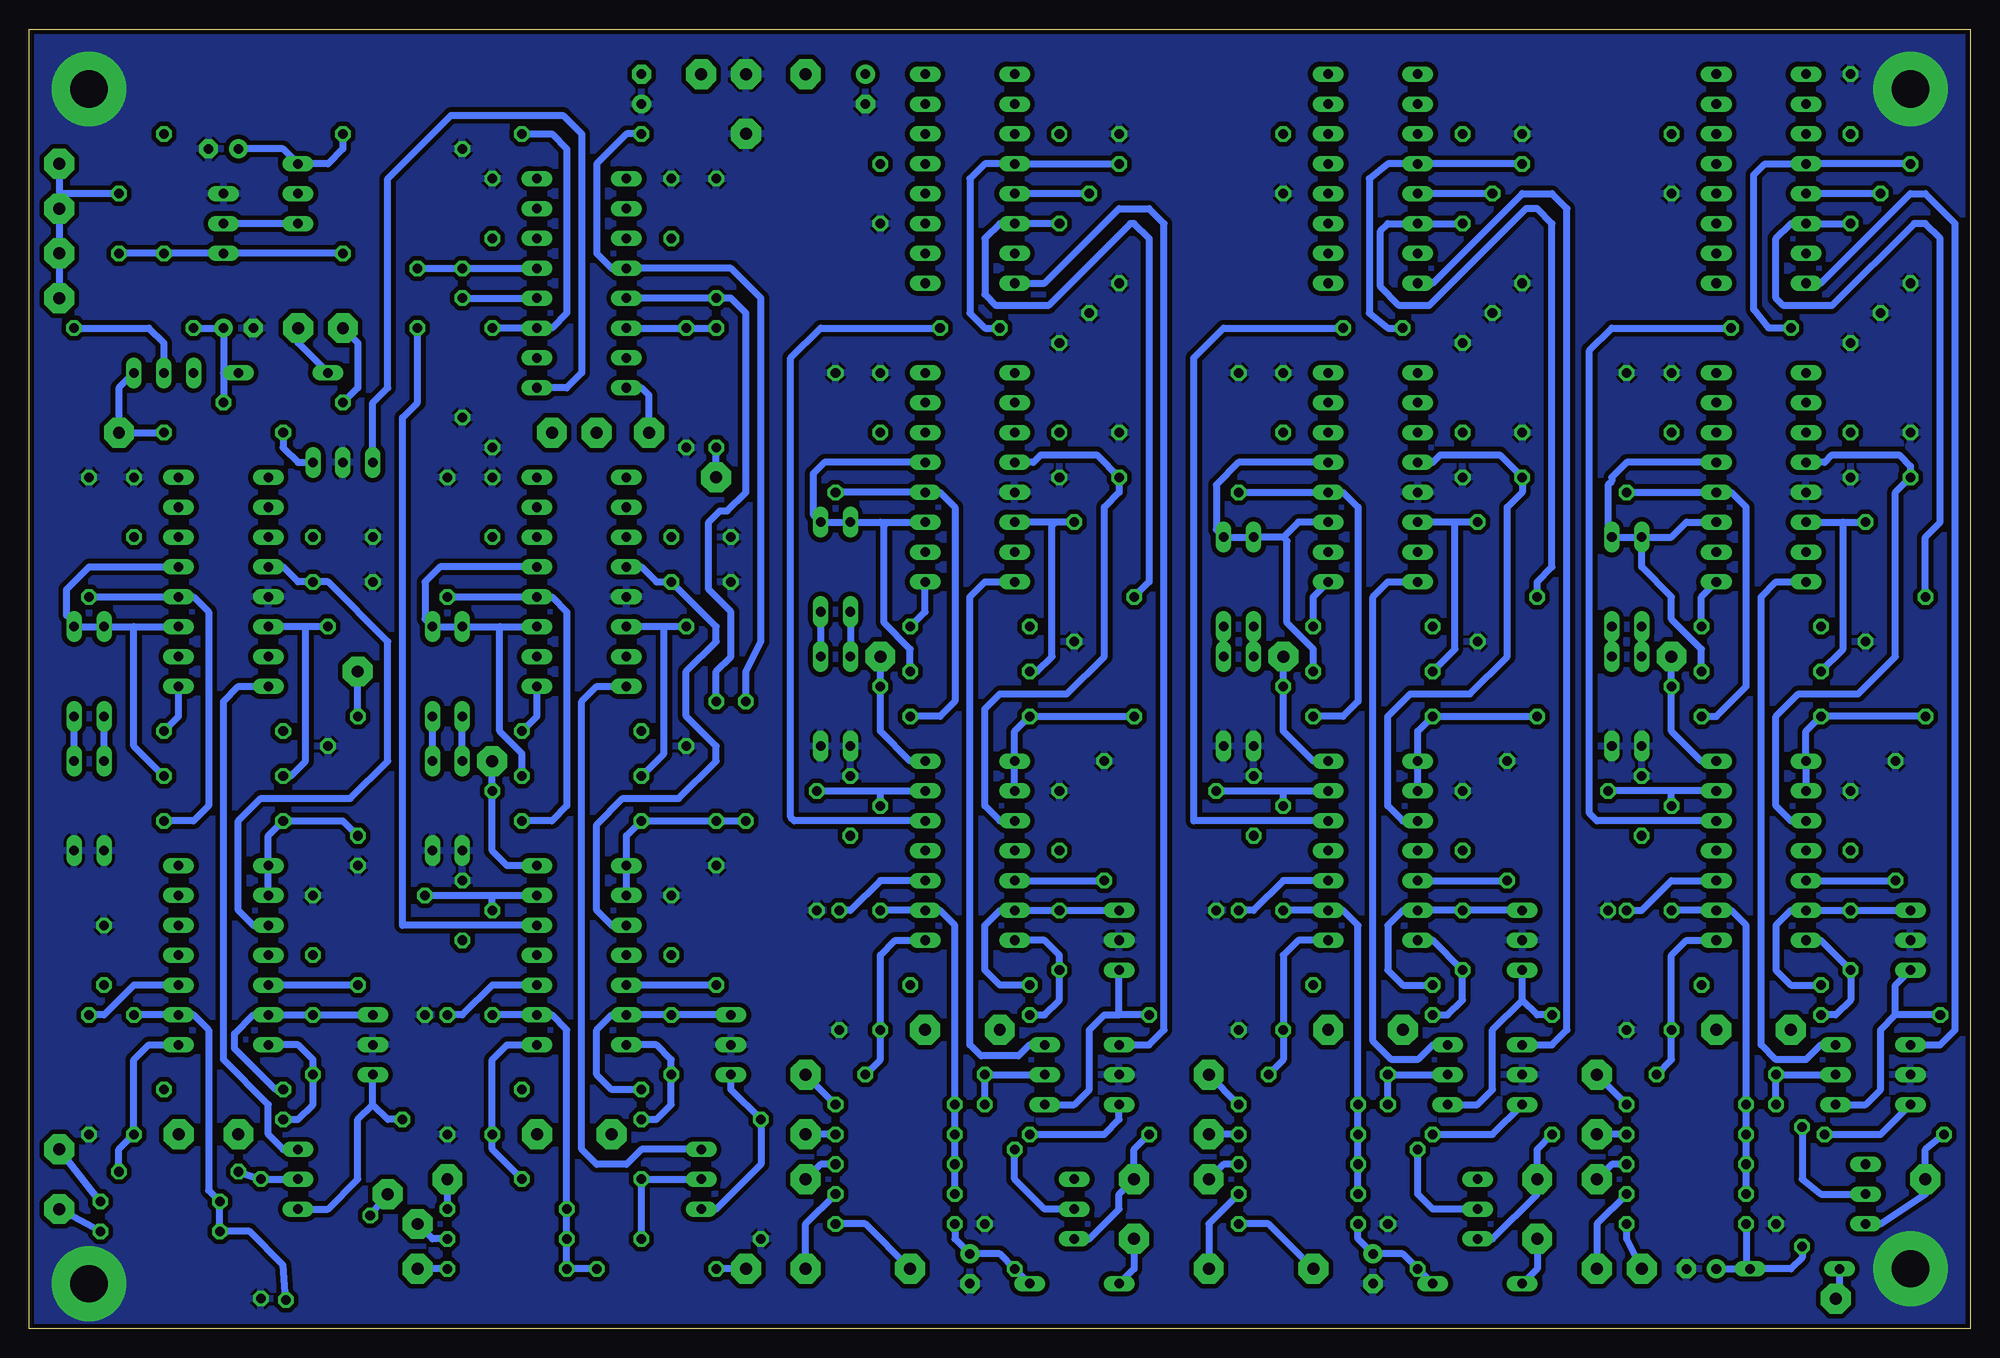
[diagram p6: board, bottom side, seen from below]

Size 165.1 x 110.49 mm. Coordinates in mm from the lower left corner, seen from the top.
Outline: 0,0 165.1,0 165.1,110.49 0,110.49 0,0
Copper layers (1*16): Top 0.035mm / dielectric 1.5mm / Bottom 0.035mm
Design rules "SeeedStudio_2layer_DRU_no_angle_20140221": minimum track width 6mil, minimum drill 12mil, track to track 6mil, track to pad 6mil, pad to pad 6mil, via to via 6mil, smd to smd 0mil, copper to edge 10mil, drill to drill 10mil, minimum pad ring 10mil, minimum via ring 6mil, stop-mask expansion 2mil, vias tented up to drill 100mil, thermal gap 10mil

### Footprints (pad centres in the part's own frame; a part is rotated, then mirrored left to right if it is on the bottom)
2,54/1,0 = drill 1.016 pad 2.54 octagon: 1 0,0
C050-025X075 = drill 0.813 octagon: 1 -2.54,0; 2 2.54,0
E2,5-5 = drill 0.813 pad 1.6: + -1.27,0 | drill 0.813 pad 1.6 octagon: - 1.27,0
DO35-7 = drill 0.813 long: A 3.81,0; C -3.81,0
DIL16 = drill 0.813 long: 1 -8.89,-3.81; 2 -6.35,-3.81; 3 -3.81,-3.81; 4 -1.27,-3.81; 5 1.27,-3.81; 6 3.81,-3.81; 7 6.35,-3.81; 8 8.89,-3.81; 9 8.89,3.81; 10 6.35,3.81; 11 3.81,3.81; 12 1.27,3.81; 13 -1.27,3.81; 14 -3.81,3.81; 15 -6.35,3.81; 16 -8.89,3.81
DIL14 = drill 0.813 long: 1 -7.62,-3.81; 2 -5.08,-3.81; 3 -2.54,-3.81; 4 0,-3.81; 5 2.54,-3.81; 6 5.08,-3.81; 7 7.62,-3.81; 8 7.62,3.81; 9 5.08,3.81; 10 2.54,3.81; 11 0,3.81; 12 -2.54,3.81; 13 -5.08,3.81; 14 -7.62,3.81
0207/10 = drill 0.813 octagon: 1 -5.08,0; 2 5.08,0
TO92-EBC = drill 0.813 long: B 0,-1.27; C 2.54,-1.27; E -2.54,-1.27
TO92-ECB = drill 0.813 long: B 2.54,0; C 0,0; E -2.54,0

### Placement (x,y rotation side)
1VOA  31.75,21.59 180 top
1VOB  64.77,21.59 0 top
1VOC  99.06,21.59 0 top
1VORA  162.56,15.24 0 top
1VORB  129.54,12.7 0 top
+12V  99.06,106.68 0 top
-12V  107.95,106.68 0 top
C1  17.78,85.09 0 top
C2  10.16,43.18 90 top
C3  27.94,44.45 270 top
C4  7.62,76.2 180 top
C5  25.4,78.74 270 top
C6  22.86,5.08 0 top
C7  10.16,33.02 270 top
C10  10.16,104.14 90 top
C11  25.4,99.06 90 top
C12  50.8,85.09 0 top
C13  43.18,43.18 90 top
C14  60.96,44.45 270 top
C15  40.64,76.2 180 top
C16  58.42,78.74 270 top
C17  50.8,5.08 270 top
C18  7.62,72.39 0 top
C19  43.18,33.02 270 top
C20  40.64,72.39 0 top
C21  40.64,101.6 180 top
C22  58.42,99.06 90 top
C23  85.09,85.09 0 top
C24  77.47,43.18 90 top
C25  95.25,44.45 270 top
C26  74.93,76.2 180 top
C27  92.71,78.74 270 top
C28  85.09,5.08 270 top
C29  77.47,33.02 270 top
C30  74.93,72.39 0 top
C31  74.93,101.6 180 top
C32  92.71,96.52 90 top
C33  140.97,34.29 90 top
C34  158.75,31.75 270 top
C35  138.43,67.31 180 top
C36  156.21,69.85 270 top
C53  132.08,87.63 270 top
C54  110.49,34.29 90 top
C55  128.27,35.56 270 top
C56  107.95,67.31 180 top
C57  125.73,69.85 270 top
C58  147.32,85.09 180 top
C59  110.49,24.13 270 top
C60  107.95,63.5 180 top
C61  110.49,95.25 90 top
C62  125.73,95.25 270 top
C63  140.97,24.13 270 top
C64  138.43,63.5 180 top
C65  148.59,100.33 0 top
C66  157.48,93.98 90 top
C71  93.98,105.41 270 top
C72  113.03,105.41 90 top
CTA1  15.24,25.4 0 top
CTA2  31.75,16.51 180 top
CTA3  21.59,25.4 0 top
CTB1  48.26,25.4 0 top
CTB2  64.77,16.51 0 top
CTB3  54.61,25.4 0 top
CTC1  82.55,25.4 0 top
CTC2  99.06,16.51 0 top
CTC3  88.9,25.4 0 top
CTRA1  147.32,16.51 0 top
CTRA2  162.56,10.16 0 top
CTRA3  152.4,16.51 0 top
CTRB1  115.57,16.51 0 top
CTRB2  132.08,8.89 0 top
CTRB3  121.92,16.51 0 top
CVA2  31.75,5.08 180 top
CVB2  64.77,5.08 0 top
CVC2  99.06,5.08 0 top
CVRA2  134.62,11.43 0 top
CVRB2  104.14,5.08 0 top
D1  14.92,5.08 180 top
D3  41.91,3.81 180 top
D4  63.5,63.5 90 top
D5  30.48,63.5 90 top
D6  30.48,53.34 90 top
D7  27.94,53.34 270 top
D8  27.94,63.5 270 top
D9  63.5,53.34 90 top
D10  60.96,53.34 270 top
D11  60.96,63.5 270 top
D12  76.2,3.81 180 top
D13  97.79,64.77 90 top
D14  97.79,53.34 90 top
D15  95.25,53.34 270 top
D16  95.25,64.77 270 top
D27  143.51,81.28 180 top
D28  130.81,55.88 90 top
D29  130.81,44.45 90 top
D30  128.27,44.45 270 top
D31  128.27,55.88 270 top
D32  161.29,55.88 90 top
D33  161.29,44.45 90 top
D34  158.75,44.45 270 top
D35  158.75,55.88 270 top
DCYA1  27.94,5.08 0 top
DCYB1  55.88,5.08 0 top
DCYC1  90.17,5.08 0 top
DCYR1  138.43,85.09 0 top
GND  104.14,106.68 180 top
GNDP  104.14,101.6 180 top
IC1  17.78,97.79 90 top
IC2  17.78,40.64 270 top
IC4  17.78,72.39 90 top
IC5  50.8,97.79 90 top
IC6  50.8,72.39 90 top
IC7  50.8,40.64 270 top
IC8  85.09,97.79 90 top
IC9  85.09,72.39 90 top
IC10  85.09,40.64 270 top
IC17  118.11,88.9 90 top
IC18  118.11,63.5 90 top
IC19  118.11,31.75 270 top
IC20  148.59,63.5 90 top
IC21  148.59,31.75 270 top
N1  162.56,87.63 0 top
N2  162.56,99.06 0 top
N3  162.56,95.25 270 top
N4  162.56,91.44 270 top
R1  24.13,8.89 180 top
R2  14.29,12.06 270 top
R3  7.3,16.51 180 top
R4  10.16,88.9 270 top
R5  7.62,91.44 270 top
R6  3.81,57.15 90 top
R7  5.08,93.98 270 top
R8  24.13,19.05 180 top
R9  24.13,13.97 180 top
R10  25.4,30.48 270 top
R11  29.21,30.48 90 top
R12  16.51,13.97 90 top
R13  17.78,29.21 0 top
R14  7.62,26.67 0 top
R15  6.35,43.18 90 top
R16  24.13,16.51 180 top
R17  24.13,11.43 180 top
R19  17.78,55.88 180 top
R20  17.78,52.07 0 top
R21  8.89,63.5 270 top
R22  29.21,76.2 90 top
R23  17.78,59.69 180 top
R30  21.59,21.59 0 top
R31  30.8,40.64 270 top
R32  25.4,49.53 90 top
R33  57.15,8.89 180 top
R34  46.99,10.16 270 top
R35  40.64,16.51 180 top
R36  43.18,88.9 270 top
R37  40.64,91.44 270 top
R38  36.83,57.15 90 top
R39  38.1,93.98 270 top
R40  57.15,19.05 180 top
R41  57.15,13.97 180 top
R42  58.42,30.48 270 top
R43  62.23,30.48 90 top
R44  49.53,13.97 90 top
R45  50.8,29.21 0 top
R46  40.64,26.67 0 top
R47  39.37,43.18 90 top
R48  57.15,16.51 180 top
R49  50.8,55.88 180 top
R50  50.8,52.07 0 top
R51  41.91,63.5 270 top
R52  62.23,76.2 90 top
R53  50.8,59.69 180 top
R54  57.15,11.43 180 top
R55  54.61,21.59 0 top
R56  64.14,40.64 270 top
R57  58.42,49.53 90 top
R58  91.44,8.89 180 top
R59  81.28,10.16 270 top
R60  74.93,16.51 180 top
R61  77.47,88.9 270 top
R62  74.93,91.44 270 top
R63  71.12,57.15 90 top
R64  72.39,93.98 270 top
R65  91.44,19.05 180 top
R66  91.44,13.97 180 top
R67  92.71,30.48 270 top
R68  96.2,30.48 90 top
R69  83.82,13.97 90 top
R70  85.09,29.21 0 top
R71  74.93,26.67 0 top
R72  73.66,43.18 90 top
R73  91.44,16.51 180 top
R74  85.09,55.88 180 top
R75  85.09,52.07 0 top
R76  76.2,63.5 270 top
R77  96.52,76.2 90 top
R78  85.09,59.69 180 top
R79  91.44,11.43 180 top
R80  88.9,21.59 0 top
R81  98.11,40.64 270 top
R82  92.71,49.53 90 top
R133  143.51,78.74 0 top
R134  156.21,85.09 180 top
R135  148.59,76.2 0 top
R136  125.73,80.01 270 top
R137  128.27,82.55 270 top
R138  118.11,101.6 0 top
R139  128.27,95.25 90 top
R140  124.46,10.16 180 top
R141  124.46,5.08 180 top
R142  125.73,21.59 270 top
R143  129.54,21.59 90 top
R144  107.95,7.62 0 top
R145  118.11,20.32 0 top
R146  107.95,17.78 0 top
R147  106.68,34.29 90 top
R148  124.46,7.62 180 top
R149  118.11,46.99 180 top
R150  118.11,43.18 0 top
R151  109.22,54.61 270 top
R152  129.54,67.31 90 top
R153  118.11,50.8 180 top
R154  111.76,5.08 0 top
R155  118.11,12.7 0 top
R156  131.44,31.75 270 top
R157  125.73,40.64 90 top
R158  153.99,10.79 180 top
R159  137.16,46.99 90 top
R160  156.21,21.59 270 top
R161  160.02,21.59 90 top
R162  145.41,7.62 90 top
R163  148.59,20.32 0 top
R164  138.43,17.78 0 top
R165  137.16,34.29 90 top
R166  153.99,8.26 180 top
R167  148.59,46.99 180 top
R168  148.59,43.18 0 top
R169  139.7,54.61 270 top
R170  160.02,67.31 90 top
R171  148.59,50.8 180 top
R172  139.7,6.03 315 top
R173  152.4,13.34 0 top
R174  106.68,80.01 90 top
R175  109.22,80.01 90 top
R176  106.68,48.26 90 top
R177  106.68,92.71 270 top
R178  104.14,48.26 90 top
R189  138.43,96.52 90 top
R190  153.67,96.52 270 top
RNG1  125.73,48.26 0 top
SWA1  3.81,12.7 270 top
SWA2  31.75,12.7 180 top
SWB1  36.83,12.7 0 top
SWB2  64.77,12.7 0 top
SWC1  71.12,12.7 0 top
SWC2  99.06,12.7 0 top
SWR1  157.48,76.2 0 top
SWR2  132.08,5.08 0 top
T1  7.62,11.43 90 top
T2  3.81,21.59 90 top
T3  10.16,21.59 90 top
T4  3.81,33.02 90 top
T7  40.64,10.16 90 top
T8  36.83,21.59 90 top
T9  43.18,21.59 90 top
T10  36.83,33.02 90 top
T11  74.93,10.16 90 top
T12  71.12,21.59 90 top
T13  77.47,21.59 90 top
T14  71.12,33.02 90 top
T23  153.67,80.01 180 top
T24  138.43,72.39 180 top
T25  106.68,12.7 90 top
T26  104.14,24.13 90 top
T27  140.97,12.7 90 top
T28  134.62,24.13 90 top
T32  142.24,96.52 270 top
T33  149.86,93.98 270 top
TRGA  11.43,2.54 0 top
TRGB  36.83,7.62 0 top
TRGC  71.12,7.62 0 top
TRGR  142.24,85.09 0 top
V11  25.4,57.15 0 top
V21  58.42,57.15 0 top
V31  92.71,57.15 0 top
X1  137.16,55.88 0 top
X3  112.39,76.2 0 top
Y1  116.84,76.2 0 top
Y2  106.68,72.39 0 top
Y3  120.65,76.2 0 top

### Tracks (layer width: path | path; a pad name or v marks a point on that pad's centre or on a via)
+12V
  pour Top (isolate 0.406, rank 2): 17.78,110.49 0,110.49 0,0 148.59,0 148.59,71.12 156.21,71.12 156.21,104.14 133.35,104.14 133.35,13.97 118.11,13.97 118.11,101.6 105.41,101.6 105.41,107.95 87.63,107.95 87.63,102.87 100.33,102.87 100.33,21.59 85.09,21.59 85.09,102.87 66.04,102.87 66.04,21.59 50.8,21.59 50.8,104.14 33.02,104.14 33.02,21.59 17.78,21.59
-12V
  Top 0.813: C3.2 24.13,41.91 22.86,40.64 IC2.11
  pour Top (isolate 0.406): 17.78,110.49 33.02,110.49 33.02,21.59 17.78,21.59
  pour Top (isolate 0.406): 50.8,110.49 66.04,110.49 66.04,21.59 50.8,21.59
  pour Top (isolate 0.406): 85.09,102.87 100.33,102.87 100.33,21.59 85.09,21.59
  pour Top (isolate 0.406): 118.11,110.49 133.35,110.49 133.35,13.97 118.11,13.97
  pour Top (isolate 0.406): 148.59,71.12 165.1,71.12 165.1,0 148.59,0
  pour Top (isolate 0.406): 31.75,110.49 50.8,110.49 50.8,104.14 31.75,104.14
  pour Top (isolate 0.406): 66.04,110.49 90.17,110.49 90.17,102.87 66.04,102.87
  pour Top (isolate 0.406, no thermals): 78.74,110.49 118.11,110.49 118.11,101.6 105.41,101.6 105.41,107.95 78.74,107.95
  pour Top (isolate 0.406): 133.35,110.49 165.1,110.49 165.1,71.12 156.21,71.12 156.21,104.14 133.35,104.14
GND  (via drill 3.17 pad 6.35)
  Top 0.61: C56.2 109.22,71.12 R175.1 | R31.2 30.8,42.86 27.94,45.72 C3.1 | C25.1 95.25,44.45 97.79,41.91 97.79,35.88 R81.2 | C55.1 128.27,36.83 131.44,33.66 R156.2 | R151.2 109.22,41.91 R147.2 | C14.1 60.96,44.77 64.14,41.59 R56.2 | T4.B 2.54,33.02 1.27,31.75 1.27,22.86 2.54,21.59 T2.B
  other vias: 5.08,105.41 160.02,105.41 160.02,3.81 5.08,5.08
  pour Bottom (isolate 0.406, rank 2): 0,110.49 165.1,110.49 165.1,0 0,0
N$1
  Bottom 0.61: R2.1 14.29,12.7 12.7,11.43 T1.B
N$2
  Bottom 0.61: T1.E 7.62,8.89 3.81,11.43 SWA1.1 3.81,15.24 R3.2
N$3
  Bottom 0.61: R3.1 7.62,16.51 T2.E
N$4
  Bottom 0.61: R2.2 14.29,6.03 15.24,5.08 D1.C | C6.+ D1.C | R1.2 19.05,5.4 D1.C
N$5
  Bottom 0.61: DCYA1.1 29.21,7.62 R1.1
N$6
  Bottom 0.61: T2.C 2.54,24.13 1.27,25.4 1.27,93.98 3.81,96.52 5.08,96.52 12.7,88.9 IC1.16
N$7
  Bottom 0.61: R6.2 3.81,67.31 2.54,68.58 2.54,92.71 3.81,93.98 4.76,93.98 11.75,87 15.88,87 16.51,87.63 16.51,92.71 15.24,93.98 IC1.14 R4.1
N$8
  Bottom 0.61: R5.1 IC1.13
N$9
  Bottom 0.61: C1.1 17.14,85.09 18.41,86.68 18.41,98.11 17.46,99.06 IC1.12 R7.1
N$10
  Bottom 0.61: D1.A 11.11,2.86 TRGA.1
N$11
  Bottom 0.61: R9.1 30.48,13.97 SWA2.1
N$12
  Bottom 0.61: R16.1 CTA2.1
N$13
  Bottom 0.61: IC2.12 31.75,43.18 32.38,43.81 32.38,83.19 30.48,85.09 C1.2
N$14
  Bottom 0.61: R8.1 1VOA.1
N$15
  Bottom 0.61: R11.2 27.94,35.56 25.4,38.1 IC2.10
N$16
  Bottom 0.61: R17.2 R9.2 R16.2 R8.2 19.05,34.29 20.32,35.56 IC2.9 R10.1
N$17
  Bottom 0.61: R30.2 25.4,22.86 R10.2 25.4,31.75 24.13,33.02 IC2.8
N$18
  Bottom 0.61: IC2.13 25.4,45.72 | 25.4,45.72 R31.1 | R32.1 25.4,45.72
N$19
  Bottom 0.61: T3.E 8.89,19.05 7.62,20.32 7.62,25.4 6.35,26.67 | 6.35,26.67 6.35,29.21 T4.E | R14.1 6.35,26.67
N$20
  Bottom 0.61: R17.1 31.75,8.89 CVA2.1
N$21
  Bottom 0.61: T4.C C7.1 IC2.6 15.24,35.56 16.51,34.29 16.51,30.48 15.24,29.21 R13.1
N$22
  Bottom 0.61: IC2.7 12.7,33.02 C7.2 10.16,27.94 11.43,26.67 R14.2
N$23
  Bottom 0.61: IC2.5 R15.1
N$24
  Bottom 0.61: R12.2 R30.1 T3.B
N$25
  Bottom 0.61: T3.C 12.7,24.13 13.97,22.86 16.51,22.86 17.78,24.13 17.78,62.23 16.51,63.5 IC4.16
N$26
  Bottom 0.61: IC4.14 10.79,68.58 | 10.79,68.58 R21.1 | R19.2 10.79,57.78 10.79,68.58
N$27
  Bottom 0.61: R22.1 IC4.4 20.32,71.12 19.05,69.85 19.05,54.61 21.59,52.07 R20.2
N$28
  Bottom 0.61: IC2.3 15.24,43.18 16.51,44.45 16.51,52.07 14.61,53.98 9.53,53.98 6.35,57.15 6.35,71.12 C18.1 5.08,73.34 6.03,74.3 11.75,74.3 12.38,73.66 IC4.12
N$40
  Bottom 0.61: D3.C R34.2 48.26,6.35 C17.+ 52.07,7.62 R33.2
N$41
  Bottom 0.61: T7.B 45.72,10.16 46.99,11.43 R34.1
N$42
  Bottom 0.61: T7.E 40.64,7.62 36.83,11.43 SWB1.1 36.83,15.24 R35.2
N$43
  Bottom 0.61: R35.1 40.64,16.51 T8.E
N$44
  Bottom 0.61: R38.2 36.83,63.5 35.56,64.77 35.56,93.98 36.83,95.25 37.78,95.25 46.04,87 48.58,87 50.16,88.58 50.16,93.34 49.53,93.98 IC5.14 R36.1
N$45
  Bottom 0.61: R37.1 IC5.13
N$46
  Bottom 0.61: R39.1 IC5.12 49.53,99.06 51.12,97.79 51.12,86.36 49.53,85.09 C12.1
N$47
  Bottom 0.61: TRGB.1 36.83,5.08 D3.A
N$48
  Bottom 0.61: DCYB1.1 59.69,8.89 R33.1
N$49
  Bottom 0.61: R41.1 63.5,13.97 SWB2.1
N$50
  Bottom 0.61: R40.1 1VOB.1
N$51
  Bottom 0.61: IC7.10 58.42,38.1 60.96,35.56 R43.2
N$52
  Bottom 0.61: R23.1 22.86,62.23 IC4.1
N$53
  Bottom 0.61: R54.2 R41.2 R48.2 R40.2 52.07,34.29 53.34,35.56 IC7.9 R42.1
N$54
  Bottom 0.61: IC7.8 57.15,33.02 58.42,31.75 R42.2 58.42,22.86 R55.2
N$55
  Bottom 0.61: T9.E 41.91,19.05 40.64,20.32 40.64,25.4 38.1,27.94 | 38.1,27.94 T10.E | R46.1 36.83,26.67 38.1,27.94
N$56
  Bottom 0.61: D6.A D5.C
N$57
  Bottom 0.61: D7.C D8.A
N$58
  Bottom 0.61: T10.C C19.1 IC7.6 48.26,35.56 49.53,34.29 49.53,30.48 48.26,29.21 R45.1
N$59
  Bottom 0.61: R46.2 44.45,26.67 43.18,27.94 C19.2 45.72,33.02 IC7.7
N$60
  Bottom 0.61: IC7.5 R47.1
N$61
  Bottom 0.61: R44.2 R55.1 T9.B
N$62
  Bottom 0.61: R51.1 43.81,68.58 | 43.81,68.58 IC6.14 | R49.2 43.81,57.78 43.81,68.58
N$63
  Bottom 0.61: R52.1 IC6.4 53.34,71.12 52.07,69.85 52.07,53.34 53.34,52.07 R50.2
N$64
  Bottom 0.61: R53.1 55.88,62.23 IC6.1
N$65
  Bottom 0.61: D9.A D4.C
N$66
  Bottom 0.61: D10.C D11.A
N$67
  Bottom 0.61: IC7.3 48.26,43.18 49.53,44.45 49.53,52.07 47.62,53.98 42.55,53.98 39.37,57.15 39.37,69.85 38.1,71.12 C20.1 40.01,74.3 45.09,74.3 45.72,73.66 IC6.12
N$68
  Bottom 0.61: R54.1 64.77,8.89 CVB2.1
N$69
  Bottom 0.61: T9.C 45.72,24.13 46.99,22.86 49.21,22.86 50.8,24.45 50.8,62.23 49.53,63.5 IC6.16
N$70
  Bottom 0.61: T8.C 35.56,24.13 34.29,25.4 34.29,95.25 35.56,96.52 38.1,96.52 45.72,88.9 IC5.16
N$71
  Bottom 0.61: IC7.12 66.04,43.18 66.04,82.55 63.5,85.09 C12.2
N$72
  Bottom 0.61: R56.1 58.42,45.72 | 58.42,45.72 IC7.13 | R57.1 58.42,45.72
N$73
  Bottom 0.61: R48.1 CTB2.1
N$74
  Bottom 0.61: D12.C R59.2 82.55,6.35 C28.+ 86.36,7.62 R58.2
N$75
  Bottom 0.61: T11.B 78.74,10.16 81.28,12.7 R59.1
N$76
  Bottom 0.61: T11.E 74.93,7.62 72.39,10.16 72.39,11.43 SWC1.1 71.12,15.24 R60.2
N$77
  Bottom 0.61: R60.1 73.66,16.51 72.39,17.78 T12.E
N$78
  Bottom 0.61: R61.1 IC8.14 82.55,93.98 83.82,92.71 83.82,87.95 82.87,87 78.42,87 71.44,93.98 71.12,93.98 69.85,92.71 69.85,63.5 R63.2
N$79
  Bottom 0.61: R62.1 IC8.13
N$80
  Bottom 0.61: R64.1 IC8.12 83.82,99.06 85.09,97.79 85.09,86.36 83.82,85.09 C23.1
N$81
  Bottom 0.61: TRGC.1 71.12,5.08 D12.A
N$82
  Bottom 0.61: DCYC1.1 93.98,8.89 R58.1
N$83
  Bottom 0.61: R66.1 97.79,13.97 SWC2.1
N$84
  Bottom 0.61: R65.1 1VOC.1
N$85
  Bottom 0.61: IC10.10 92.71,38.1 95.25,35.56 R68.2
N$86
  Bottom 0.61: R79.2 R66.2 R73.2 R65.2 86.36,34.29 87.63,35.56 IC10.9 R67.1
N$87
  Bottom 0.61: R80.2 92.71,22.86 R67.2 92.71,31.75 91.44,33.02 IC10.8
N$88
  Bottom 0.61: T13.E 76.2,19.05 74.93,20.32 74.93,25.4 73.66,26.67 72.39,26.67 | 72.39,26.67 T14.E | R71.1 72.39,26.67
N$89
  Bottom 0.61: R70.1 82.55,29.21 83.82,30.48 83.82,34.29 82.55,35.56 IC10.6 C29.1 T14.C
N$90
  Bottom 0.61: R71.2 78.74,26.67 77.47,27.94 C29.2 77.47,31.75 78.74,33.02 IC10.7
N$91
  Bottom 0.61: IC10.5 R72.1
N$92
  Bottom 0.61: R69.2 R80.1 T13.B
N$93
  Bottom 0.61: R74.2 79.38,55.88 78.11,57.15 78.11,68.26 77.79,68.58 | R76.1 77.79,68.58 | 77.79,68.58 IC9.14
N$94
  Bottom 0.61: R77.1 IC9.4 87.63,71.12 86.36,69.85 86.36,53.34 87.63,52.07 R75.2
N$95
  Bottom 0.61: R78.1 88.9,60.96 IC9.1
N$96
  Bottom 0.61: D13.C D14.A
N$97
  Bottom 0.61: D16.A D15.C
N$98
  Bottom 0.61: IC10.3 82.55,43.18 83.82,44.45 83.82,52.7 82.55,53.98 76.83,53.98 73.66,57.15 73.66,69.85 72.39,71.12 C30.1 74.3,74.3 79.06,74.3 79.69,73.66 IC9.12
N$99
  Bottom 0.61: CVC2.1 99.06,8.89 R79.1
N$100
  Bottom 0.61: T13.C 80.01,24.13 80.96,23.18 84.14,23.18 85.09,24.13 85.09,62.23 83.82,63.5 IC9.16
N$101
  Bottom 0.61: T12.C 69.85,24.13 68.58,25.4 68.58,93.98 69.85,95.25 72.39,95.25 78.74,88.9 IC8.16
N$102
  Bottom 0.61: IC10.12 100.01,43.18 100.33,43.5 100.33,82.55 97.79,85.09 C23.2
N$103
  Bottom 0.61: R81.1 92.71,45.72 | 92.71,45.72 IC10.13 | R82.1 92.71,45.72
N$104
  Bottom 0.61: R73.1 CTC2.1
N$167
  Bottom 0.61: R134.2 C58.+ 148.59,81.28 | 148.59,81.28 R133.2 | D27.C 148.59,81.28
N$168
  Bottom 0.61: R134.1 154.94,85.09 153.67,83.82 T23.B
N$169
  Bottom 0.61: R135.2 SWR1.1 157.48,80.01 T23.E
N$170
  Bottom 0.61: R135.1 143.51,74.93 142.24,73.66 T24.E
N$171
  Bottom 0.61: R136.1 IC17.3 120.65,85.09 119.38,86.36 119.38,100.33 120.65,101.6 R138.2
N$172
  Bottom 0.61: R137.1 IC17.4
N$173
  Bottom 0.61: IC17.5 R139.1 C53.1
N$174
  Bottom 0.61: TRGR.1 142.24,83.82 D27.A
N$175
  Bottom 0.61: DCYR1.1 137.16,83.82 137.16,80.01 R133.1
N$176
  Bottom 0.61: R141.1 SWR2.1
N$177
  Bottom 0.61: R140.1 1VORB.1
N$178
  Bottom 0.61: IC19.10 125.73,29.21 128.27,26.67 R143.2
N$179
  Bottom 0.61: R154.2 R141.2 R148.2 R140.2 119.38,25.4 120.65,26.67 IC19.9 R142.1
N$180
  Bottom 0.61: R155.2 125.73,15.24 R142.2 125.73,22.86 124.46,24.13 IC19.8
N$181
  Bottom 0.61: T25.E 106.68,10.16 102.87,13.97 R146.1 105.41,20.32 T26.E
N$182
  Bottom 0.61: T26.C C59.1 IC19.6 115.57,26.67 116.84,25.4 116.84,21.59 115.57,20.32 R145.1
N$183
  Bottom 0.61: R146.2 111.76,17.78 110.49,19.05 C59.2 110.49,22.86 111.76,24.13 IC19.7
N$184
  Bottom 0.61: R147.1 IC19.5
N$185
  Bottom 0.61: R144.2 R155.1 T25.B
N$186
  Bottom 0.61: R151.1 111.12,59.69 | 111.12,59.69 IC18.14 | R149.2 111.12,48.9 111.12,59.69
N$187
  Bottom 0.61: R152.1 IC18.4 120.65,62.23 119.38,60.96 119.38,44.45 120.65,43.18 R150.2
N$188
  Bottom 0.61: R153.1 121.92,52.07 IC18.1
N$189
  Bottom 0.61: D29.A D28.C
N$190
  Bottom 0.61: D30.C D31.A
N$191
  Bottom 0.61: IC18.12 113.03,64.77 111.76,63.5 C60.1 106.68,59.69 106.68,58.42 109.22,55.88 109.22,52.07 106.68,49.53 106.68,48.26 109.86,45.09 114.62,45.09 116.84,42.86 116.84,35.56 115.57,34.29 IC19.3
N$192
  Bottom 0.61: CVRB2.1 R154.1
N$193
  Bottom 0.61: T25.C 113.03,15.24 114.3,13.97 116.84,13.97 118.11,15.24 118.11,53.34 116.84,54.61 IC18.16
N$194
  Bottom 0.61: T24.C 135.89,78.74 134.62,80.01 134.62,97.79 129.22,103.19 119.7,103.19 118.11,101.6 118.11,81.28 119.38,80.01 IC17.1
N$195
  Bottom 0.61: IC19.12 133.35,34.29 133.35,77.47 132.08,78.74 C53.2
N$196
  Bottom 0.61: R156.1 125.73,36.83 | 125.73,36.83 IC19.13 | R157.1 125.73,36.83
N$197
  Bottom 0.61: R148.1 130.81,7.62 CTRB2.1
N$198
  Bottom 0.61: X3.1 112.39,79.38 113.03,80.01 IC17.16
N$199
  Bottom 0.61: R158.1 1VORA.1
N$200
  Bottom 0.61: IC21.10 156.21,29.21 158.75,26.67 R161.2
N$201
  Bottom 0.61: R160.1 IC21.9 151.13,26.67 149.86,25.4 149.86,11.75 R158.2 R166.2 146.37,8.26 143.51,5.4 R172.2
N$202
  Bottom 0.61: R173.2 157.48,15.24 R160.2 156.21,22.86 154.94,24.13 IC21.8
N$203
  Bottom 0.61: T27.E 139.7,10.16 137.16,12.7 137.16,17.78 135.89,19.05 | 135.89,19.05 T28.E | R164.1 134.62,17.78 135.89,19.05
N$204
  Bottom 0.61: R163.1 144.15,20.32 147.64,23.81 147.64,25.08 146.05,26.67 IC21.6 C63.1 T28.C
N$205
  Bottom 0.61: R164.2 142.24,17.78 140.97,19.05 C63.2 140.97,22.86 142.24,24.13 IC21.7
N$206
  Bottom 0.61: R165.1 IC21.5
N$207
  Bottom 0.61: T27.B R162.2 R173.1
N$208
  Bottom 0.61: R169.1 141.6,59.69 | 141.6,59.69 IC20.14 | R167.2 142.88,46.99 141.6,48.26 141.6,59.69
N$209
  Bottom 0.61: R170.1 IC20.4 151.13,62.23 149.86,60.96 149.86,44.45 151.13,43.18 R168.2
N$210
  Bottom 0.61: R171.1 152.4,52.07 IC20.1
N$211
  Bottom 0.61: D33.A D32.C
N$212
  Bottom 0.61: D34.C D35.A
N$213
  Bottom 0.61: IC21.3 146.05,34.29 147.32,35.56 147.32,43.18 145.41,45.09 137.79,45.09 134.62,48.26 134.62,58.42 139.7,63.5 C64.1 142.24,63.5 143.51,64.77 IC20.12
N$214
  Bottom 0.61: R172.1 CVRA2.1
N$215
  Bottom 0.61: T27.C 143.51,15.24 144.78,16.51 144.78,19.05 148.59,22.86 148.59,53.34 147.32,54.61 IC20.16
N$216
  Bottom 0.61: R166.1 CTRA2.1
N$217
  Bottom 0.61: R159.2 X1.1
N$218
  Bottom 0.61: Y2.1 R174.1
N$219
  Bottom 0.61: IC17.14 R175.2 R174.2
N$220
  Bottom 0.61: IC17.13 R177.2 105.41,87.63 104.14,86.36 104.14,71.12 105.73,69.53 106.36,69.53 107.31,68.58 107.31,62.87 105.41,60.96 105.41,57.15 106.68,55.88 R176.2
N$221
  Bottom 0.61: R178.2 104.14,55.88 102.87,58.42 102.87,87.63 105.41,90.17 IC17.12 115.57,90.17 116.84,91.44 116.84,99.06 114.3,101.6 R138.1
N$228
  Bottom 0.61: T32.B T33.B
N$229
  Bottom 0.61: R189.2 138.43,100.33 139.7,99.06 T32.E 143.51,100.33 C65.+
N$234
  Bottom 0.61: R189.1 T33.C R190.2 C66.1
NOISE
  Bottom 0.61: N2.1 162.56,96.52 | 162.56,96.52 N3.1 N4.1 N1.1 | C66.2 162.56,96.52
OSCOS
  Bottom 0.61: D8.C D5.A 30.8,67.63 30.8,71.75 30.48,72.07 30.48,72.39 29.21,73.66 IC4.5 | D8.C 27.94,64.77 25.4,62.23 25.4,60.33 22.86,57.78 R19.1 | D8.C 25.4,67.31 24.13,68.58 IC4.3
OSCOS1
  Bottom 0.61: IC6.3 57.15,68.58 58.42,67.31 | 58.42,67.31 D11.C D4.A 64.14,67.94 64.14,71.75 62.23,73.66 IC6.5 | R49.1 55.88,57.78 58.1,60.01 58.1,66.99 58.42,67.31
OSCOS2
  Bottom 0.61: IC9.5 97.47,73.66 98.42,72.71 98.42,69.22 D13.A D16.C 92.71,68.58 | 92.71,68.58 IC9.3 | R74.1 90.17,57.78 92.39,60.01 92.39,68.26 92.71,68.58
OSCOS5
  Bottom 0.61: 125.09,59.69 D31.C D28.A 131.44,60.33 131.44,63.5 130.18,64.77 IC18.5 | 125.09,59.69 IC18.3 | R149.1 123.19,48.9 125.09,50.8 125.09,59.69
OSCOS6
  Bottom 0.61: 156.21,59.69 D35.C D32.A 161.29,60.01 161.93,60.64 161.93,62.87 160.02,64.77 IC20.5 | 156.21,59.69 IC20.3 | R167.1 156.21,49.53 156.21,59.69
OSCOT
  Bottom 0.61: IC2.2 IC2.1 13.97,50.8 R20.1 R6.1
OSCOT1
  Bottom 0.61: IC7.2 IC7.1 46.99,50.8 R50.1 R38.1
OSCOT2
  Bottom 0.61: IC10.2 IC10.1 81.28,50.8 R75.1 R63.1
OSCOT5
  Bottom 0.61: IC19.2 IC19.1 114.3,41.91 R150.1 R176.1 R178.1
OSCOT6
  Bottom 0.61: IC21.2 IC21.1 144.78,41.91 R168.1 138.43,43.18 R159.1
RING
  Bottom 0.61: IC19.14 124.46,39.37 125.73,40.64 R157.2 RNG1.1
VCO1
  Bottom 0.61: IC2.14 22.86,48.26 25.4,50.8 R32.2 V11.1
VCO2
  Bottom 0.61: IC7.14 55.88,48.26 58.42,50.8 R57.2 V21.1
VCO3
  Bottom 0.61: IC10.14 90.17,48.26 92.71,50.8 R82.2 V31.1

### Text on the board
tPlace: Noise | VCO1 | VCO2 | VCO3 | Ring VCOs | Mordent Design | uLEDRUM 1.0